# EAGLE design TesterMotorFaulhaber (EAGLE 9.6.2)
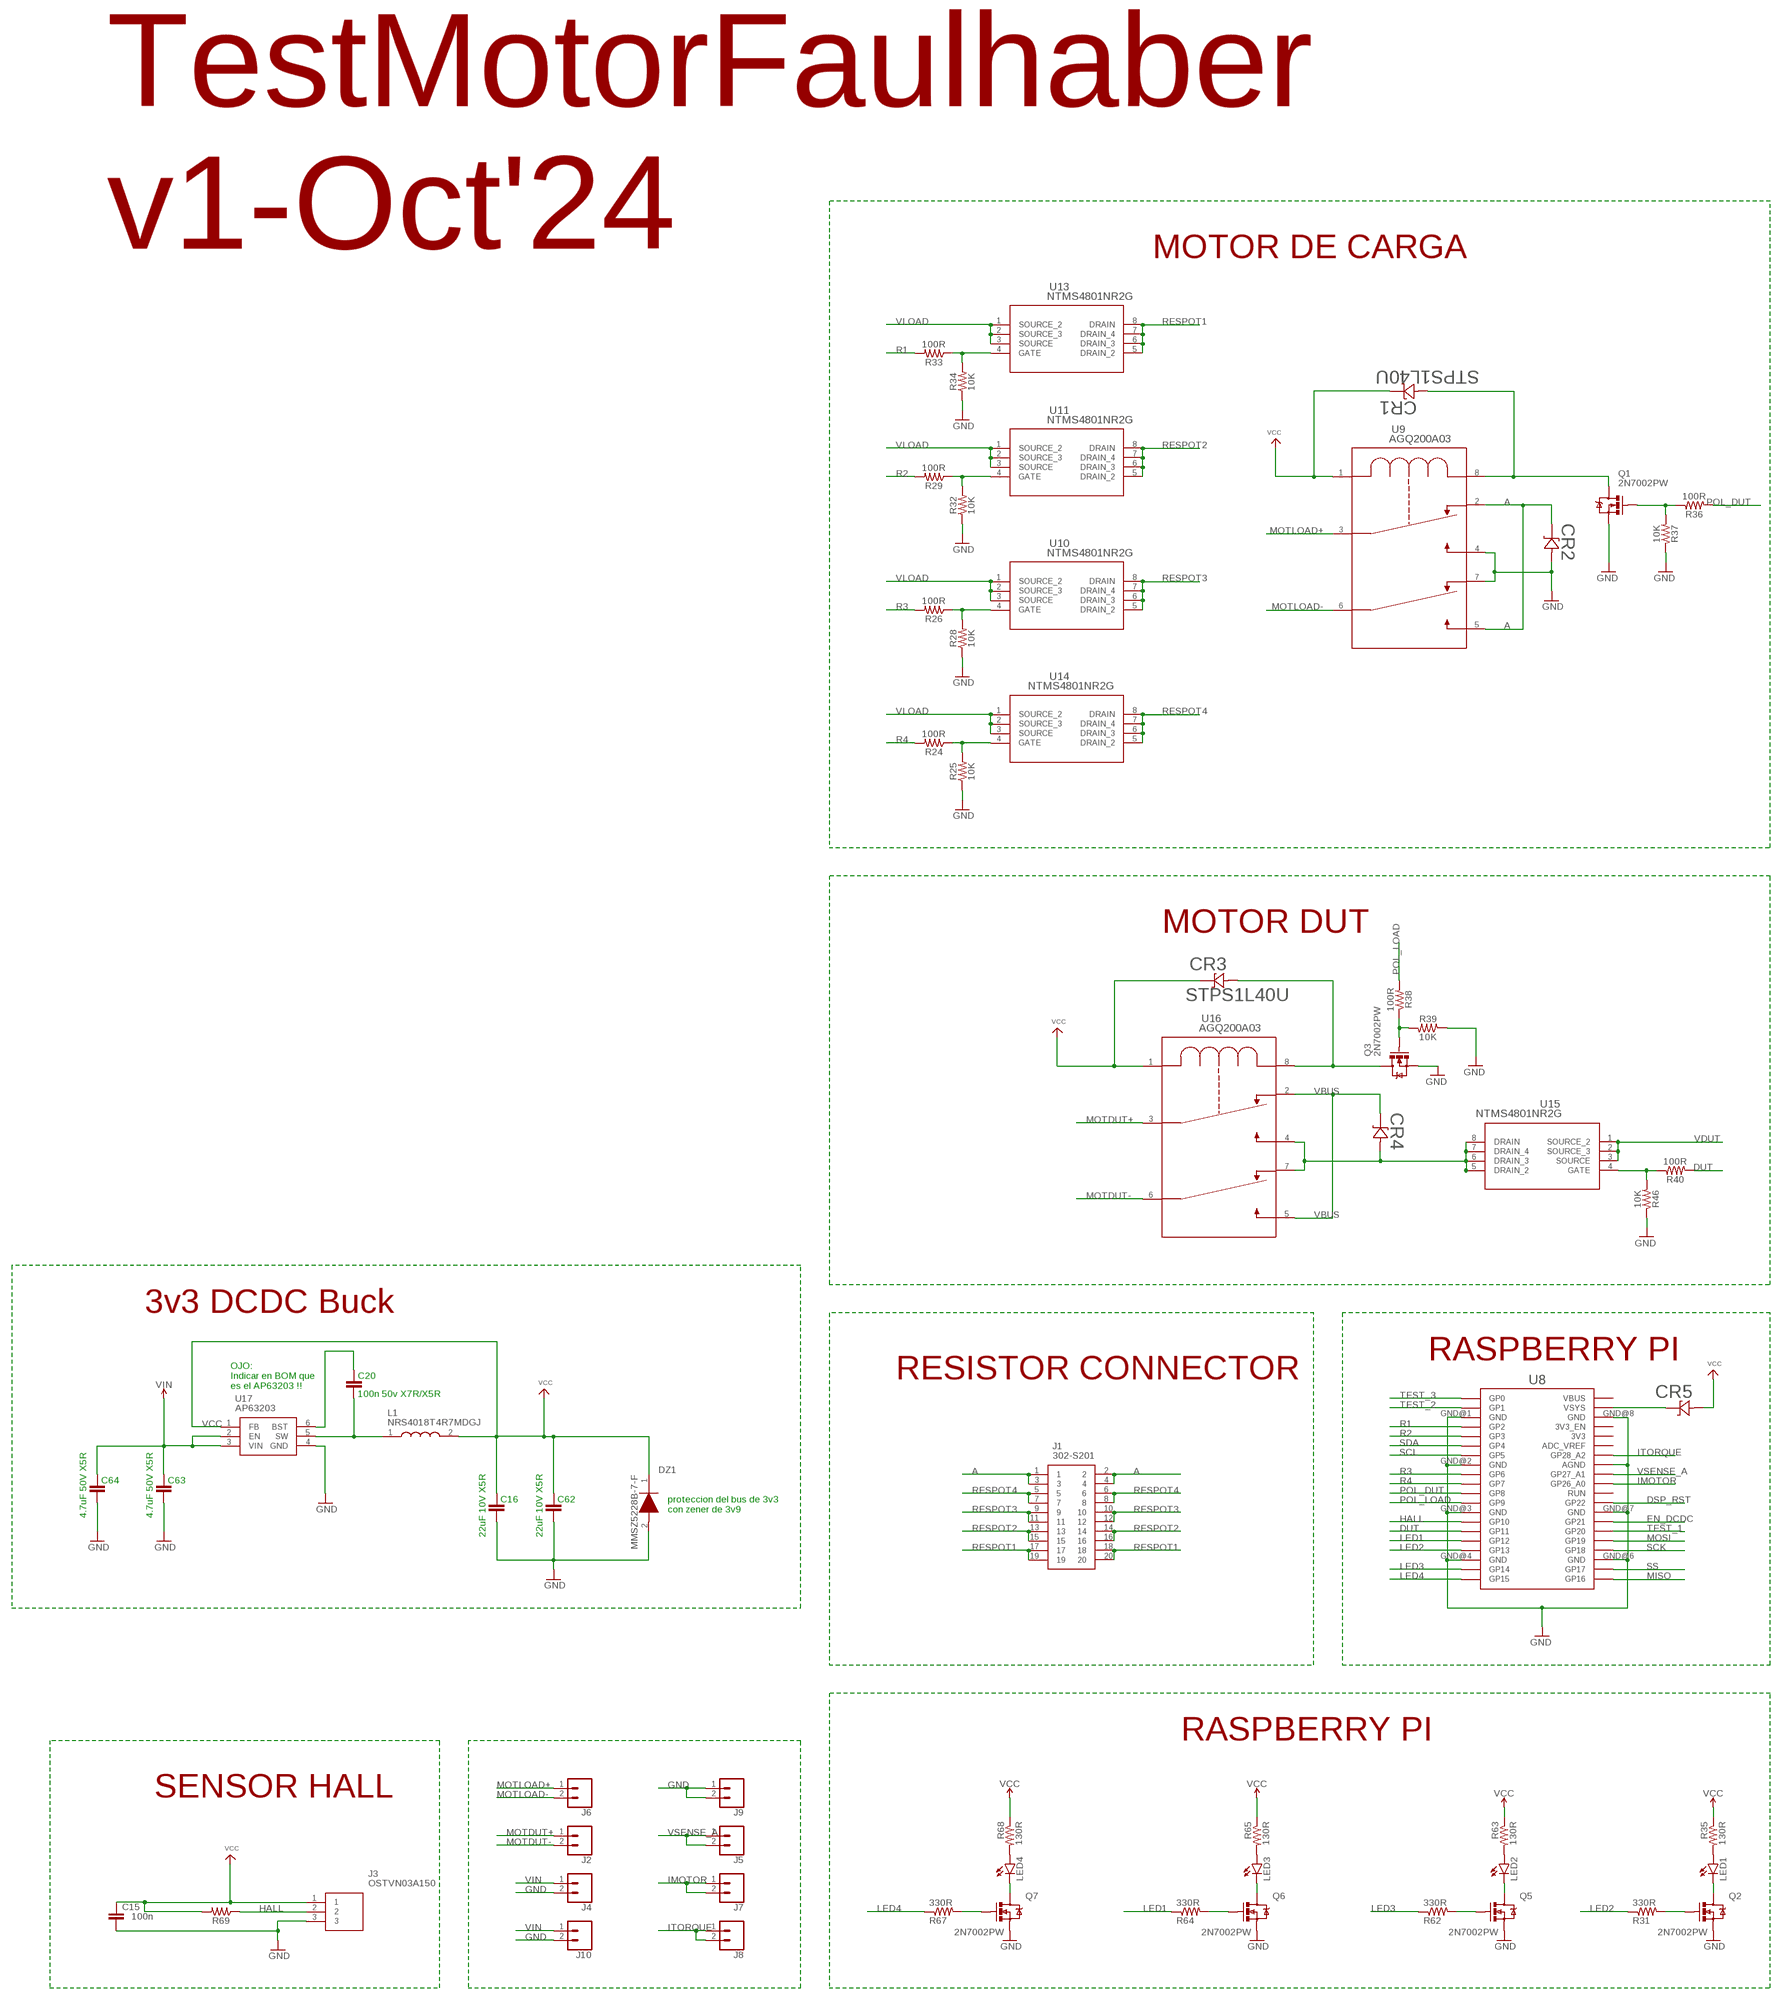
[diagram p0: schematic, sheet 1, part 1 of 2]
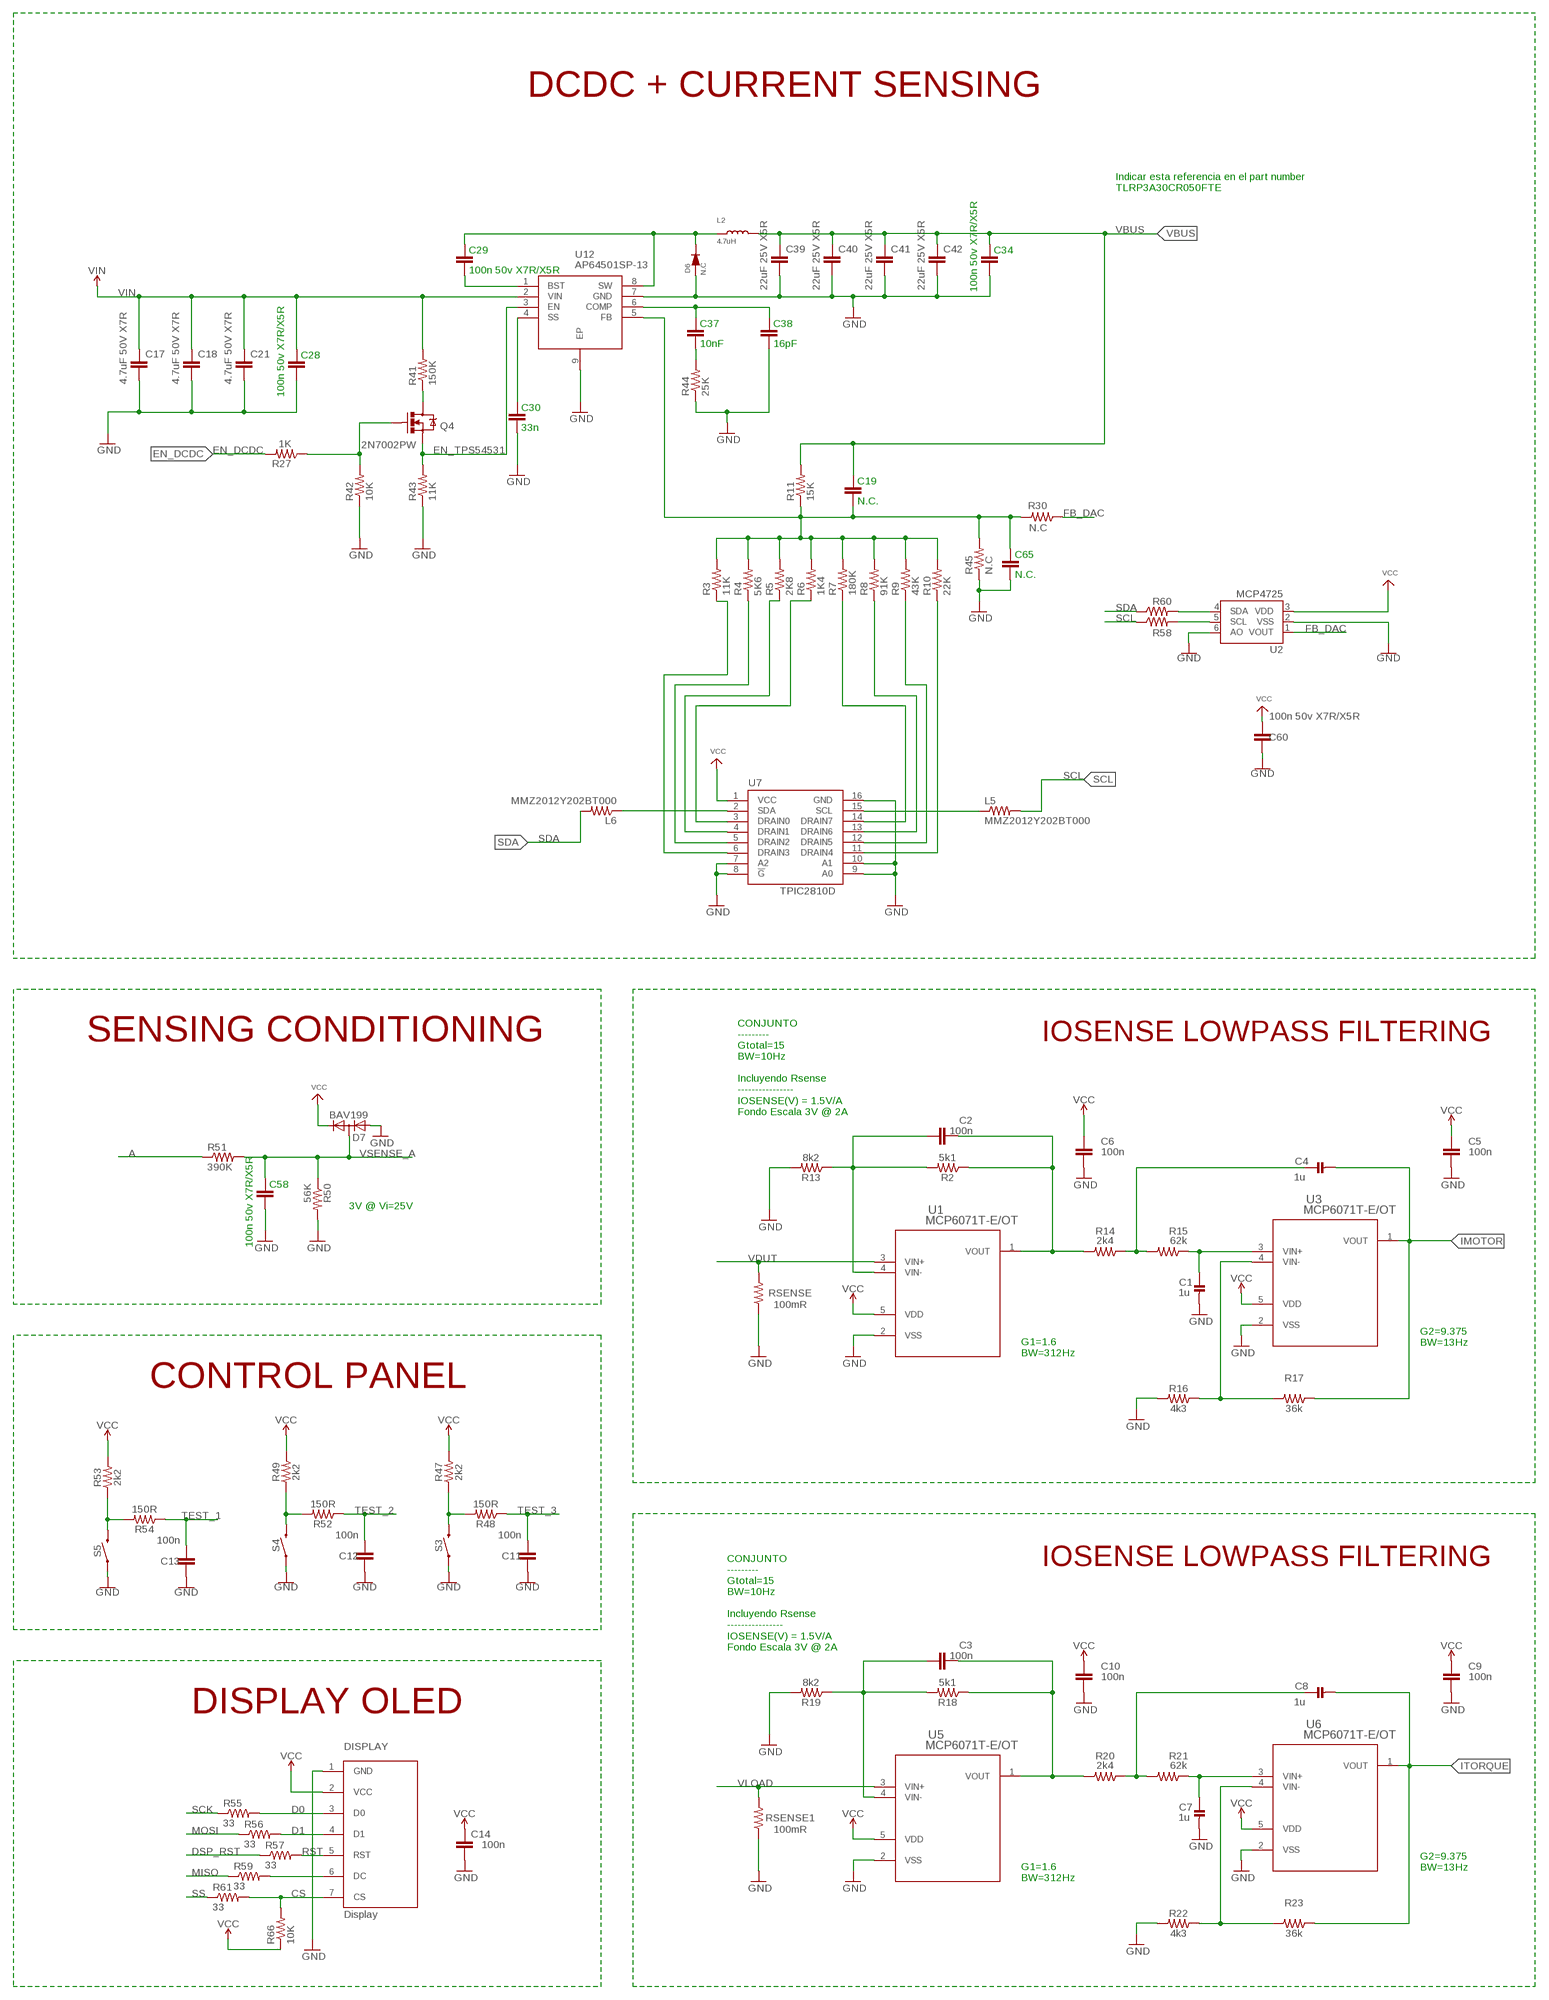
[diagram p1: schematic, sheet 1, part 2 of 2]

## Parts
C1  1u  CAP_CERAMIC0603_NO  [0603-NO]
C2  100n  0.1UF-0603-25V-(+80/-20%)  [0603]
C3  100n  0.1UF-0603-25V-(+80/-20%)  [0603]
C4  1u  CAP_CERAMIC0603_NO  [0603-NO]
C5  100n  0.1UF-0603-25V-(+80/-20%)  [0603]
C6  100n  0.1UF-0603-25V-(+80/-20%)  [0603]
C7  1u  CAP_CERAMIC0603_NO  [0603-NO]
C8  1u  CAP_CERAMIC0603_NO  [0603-NO]
C9  100n  0.1UF-0603-25V-(+80/-20%)  [0603]
C10  100n  0.1UF-0603-25V-(+80/-20%)  [0603]
C11  100n  1.0UF-0805-25V-(+80/-20%)  [0805]
C12  100n  1.0UF-0805-25V-(+80/-20%)  [0805]
C13  100n  1.0UF-0805-25V-(+80/-20%)  [0805]
C14  100n  1.0UF-0805-25V-(+80/-20%)  [0805]
C15  100n  1.0UF-0805-25V-(+80/-20%)  [0805]
C16  22uF 10V X5R  CAP0805  [0805]
C17  4.7uF 50V X7R  CAP1210  [1210]
C18  4.7uF 50V X7R  CAP1210  [1210]
C19  N.C.  CAP0805  [0805]
C20  100n 50v X7R/X5R  CAP0805  [0805]
C21  4.7uF 50V X7R  CAP1210  [1210]
C28  100n 50v X7R/X5R  CAP0805  [0805]
C29  100n 50v X7R/X5R  CAP0805  [0805]
C30  33n  CAP0805  [0805]
C34  100n 50v X7R/X5R  CAP0805  [0805]
C37  10nF  CAP0805  [0805]
C38  16pF  CAP0805  [0805]
C39  22uF 25V X5R  CAP1210  [1210]
C40  22uF 25V X5R  CAP1210  [1210]
C41  22uF 25V X5R  CAP1210  [1210]
C42  22uF 25V X5R  CAP1210  [1210]
C58  100n 50v X7R/X5R  CAP0805  [0805]
C60  100n 50v X7R/X5R  CAP0805  [0805]
C62  22uF 10V X5R  CAP0805  [0805]
C63  4.7uF 50V X5R  CAP0805  [0805]
C64  4.7uF 50V X5R  CAP0805  [0805]
C65  N.C.  CAP0805  [0805]
CR1  STPS1L40U  [SMB_STM]
CR2  STPS1L40U  [SMB_STM]
CR3  STPS1L40U  [SMB_STM]
CR4  STPS1L40U  [SMB_STM]
CR5  STPS1L40U  [SMB_STM]
D6  N.C  DSMC  [DO-214AB]
D7  BAV199  [SOT23]
DISPLAY  Display  OLED_LCD  [OLED_LCD]
DZ1  MMSZ5228B-7-F  [SODFL3518X115N]
J1  302-S201  [SHDR20W66P254_2X10_3300X905X90]
J2  CONN_02  [1X02]
J3  OSTVN03A150  [OSTVN03A150]
J4  CONN_02  [1X02]
J5  CONN_02  [1X02]
J6  CONN_02  [1X02]
J7  CONN_02  [1X02]
J8  CONN_02  [1X02]
J9  CONN_02  [1X02]
J10  CONN_02  [1X02]
L1  NRS4018T4R7MDGJ  [NRS4018T100MDGJ]
L2  4.7uH  L74437368047  [WE-LHMI]
L5  MMZ2012Y202BT000  RESISTOR0805-RES  [0805]
L6  MMZ2012Y202BT000  RESISTOR0805-RES  [0805]
LED1  LED3MM  [LED3MM]
LED2  LED3MM  [LED3MM]
LED3  LED3MM  [LED3MM]
LED4  LED3MM  [LED3MM]
Q1  2N7002PW  MOSFET-NCHANNEL2N7002PW  [SOT323]
Q2  2N7002PW  MOSFET-NCHANNEL2N7002PW  [SOT323]
Q3  2N7002PW  MOSFET-NCHANNEL2N7002PW  [SOT323]
Q4  2N7002PW  MOSFET-NCHANNEL2N7002PW  [SOT323]
Q5  2N7002PW  MOSFET-NCHANNEL2N7002PW  [SOT323]
Q6  2N7002PW  MOSFET-NCHANNEL2N7002PW  [SOT323]
Q7  2N7002PW  MOSFET-NCHANNEL2N7002PW  [SOT323]
R2  5k1  RESISTOR0805  [0805]
R3  11K  RESISTOR0805  [0805]
R4  5K6  RESISTOR0805  [0805]
R5  2K8  RESISTOR0805  [0805]
R6  1K4  RESISTOR0805  [0805]
R7  180K  RESISTOR0805  [0805]
R8  91K  RESISTOR0805  [0805]
R9  43K  RESISTOR0805  [0805]
R10  22K  RESISTOR0805  [0805]
R11  15K  RESISTOR0805  [0805]
R13  8k2  RESISTOR0805  [0805]
R14  2k4  RESISTOR0805  [0805]
R15  62k  RESISTOR0805  [0805]
R16  4k3  RESISTOR0805  [0805]
R17  36k  RESISTOR0805  [0805]
R18  5k1  RESISTOR0805  [0805]
R19  8k2  RESISTOR0805  [0805]
R20  2k4  RESISTOR0805  [0805]
R21  62k  RESISTOR0805  [0805]
R22  4k3  RESISTOR0805  [0805]
R23  36k  RESISTOR0805  [0805]
R24  100R  RESISTOR0805  [0805]
R25  10K  RESISTOR0805  [0805]
R26  100R  RESISTOR0805  [0805]
R27  1K  RESISTOR0805  [0805]
R28  10K  RESISTOR0805  [0805]
R29  100R  RESISTOR0805  [0805]
R30  N.C  RESISTOR0805  [0805]
R31  330R  RESISTOR0805  [0805]
R32  10K  RESISTOR0805  [0805]
R33  100R  RESISTOR0805  [0805]
R34  10K  RESISTOR0805  [0805]
R35  130R  RESISTOR0805  [0805]
R36  100R  RESISTOR0805  [0805]
R37  10K  RESISTOR0805  [0805]
R38  100R  RESISTOR0805  [0805]
R39  10K  RESISTOR0805  [0805]
R40  100R  RESISTOR0805  [0805]
R41  150K  RESISTOR0805  [0805]
R42  10K  RESISTOR0805  [0805]
R43  11K  RESISTOR0805  [0805]
R44  25K  RESISTOR0805  [0805]
R45  N.C  RESISTOR0805  [0805]
R46  10K  RESISTOR0805  [0805]
R47  2k2  RESISTOR0805  [0805]
R48  150R  RESISTOR0805  [0805]
R49  2k2  RESISTOR0805  [0805]
R50  56K  RESISTOR0805  [0805]
R51  390K  RESISTOR0805  [0805]
R52  150R  RESISTOR0805  [0805]
R53  2k2  RESISTOR0805  [0805]
R54  150R  RESISTOR0805  [0805]
R55  33  RESISTOR0805  [0805]
R56  33  RESISTOR0805  [0805]
R57  33  RESISTOR0805  [0805]
R58  N.C  RESISTOR0805  [0805]
R59  33  RESISTOR0805  [0805]
R60  N.C  RESISTOR0805  [0805]
R61  33  RESISTOR0805  [0805]
R62  330R  RESISTOR0805  [0805]
R63  130R  RESISTOR0805  [0805]
R64  330R  RESISTOR0805  [0805]
R65  130R  RESISTOR0805  [0805]
R66  10K  RESISTOR0805  [0805]
R67  330R  RESISTOR0805  [0805]
R68  130R  RESISTOR0805  [0805]
R69  RESISTOR0805  [0805]
RSENSE  100mR  RESISTOR1206  [1206]
RSENSE1  100mR  RESISTOR1206  [1206]
S3  MOMENTARY-SWITCH-SPST-SMD-5.2MM  [TACTILE_SWITCH_SMD_5.2MM]
S4  MOMENTARY-SWITCH-SPST-SMD-5.2MM  [TACTILE_SWITCH_SMD_5.2MM]
S5  MOMENTARY-SWITCH-SPST-SMD-5.2MM  [TACTILE_SWITCH_SMD_5.2MM]
U1  MCP6071T-E/OT  [SOT-23-5_MC_MCH]
U2  MCP4725  MCP4725SOT-23  [SOT23-6]
U3  MCP6071T-E/OT  [SOT-23-5_MC_MCH]
U5  MCP6071T-E/OT  [SOT-23-5_MC_MCH]
U6  MCP6071T-E/OT  [SOT-23-5_MC_MCH]
U7  TPIC2810D  [SO16]
U8  RPI_PICO_IG-TH  [RPI_PICO_TH]
U9  AGQ200A03  [RELAY_AGQ_A_PAN]
U10  NTMS4801NR2G  [SOIC8_4X5_ONS]
U11  NTMS4801NR2G  [SOIC8_4X5_ONS]
U12  AP64501SP-13  [SOIC127P600X163-9N]
U13  NTMS4801NR2G  [SOIC8_4X5_ONS]
U14  NTMS4801NR2G  [SOIC8_4X5_ONS]
U15  NTMS4801NR2G  [SOIC8_4X5_ONS]
U16  AGQ200A03  [RELAY_AGQ_A_PAN]
U17  AP63203  AP63201WU-7  [SOT95P280X100-6N]

## Nets
A: CR2.2 J1.1 J1.2 J1.3 J1.4 R51.1 U9.2 U9.5
CS: DISPLAY.7(CS) R61.2 R66.2
D0: DISPLAY.3(D0) R55.2
D1: DISPLAY.4(D1) R56.2
DSP_RST: R57.1 U8.GP22
DUT: R40.2 U8.GP11
EN_DCDC: R27.2 U8.GP21
EN_TPS54531: Q4.2(S) R43.2 U12.3(EN)
FB_DAC: R30.1 U2.1(VOUT)
GND: C1.2 C5.2 C6.2 C7.2 C9.2 C10.2 C11.1 C12.1 C13.1 C14.2 C15.2 C16.1 C17.2 C18.2 C21.2 C28.1 C30.1 C34.1 C38.1 C39.2 C40.2 C41.2 C42.2 C58.1 C60.1 C62.1 C63.1 C64.1 C65.1 CR2.1 D6.1(A) D7.1(A) DISPLAY.1(GND) DZ1.2(A) J3.3 J4.2 J9.1 J9.2 J10.2 Q1.2(S) Q2.2(S) Q3.2(S) Q5.2(S) Q6.2(S) Q7.2(S) R13.2 R16.2 R19.2 R22.2 R25.1 R28.1 R32.1 R34.1 R37.1 R39.1 R42.1 R43.1 R44.1 R45.1 R46.1 R50.2 RSENSE1.1 RSENSE.1 S3.1 S4.1 S5.1 U1.2(VSS) U2.2(VSS) U2.6(AO) U3.2(VSS) U5.2(VSS) U6.2(VSS) U7.7(A2) U7.8(!G) U7.9(A0) U7.10(A1) U7.16(GND) U8.AGND U8.GND@1(GND) U8.GND@2(GND) U8.GND@3(GND) U8.GND@4(GND) U8.GND@6(GND) U8.GND@7(GND) U8.GND@8(GND) U9.4 U9.7 U12.7(GND) U12.9(EP) U17.4(GND)
HALL: J3.2 R69.1 U8.GP10
IMOTOR: C4.2 J7.1 J7.2 R17.1 U3.1(VOUT) U8.GP26_A0
ISENSE_RAW: C2.1 R2.1 R14.2 U1.1(VOUT)
ISENSE_RAW1: C3.1 R18.1 R20.2 U5.1(VOUT)
ITORQUE: C8.2 J8.1 J8.2 R23.1 U6.1(VOUT) U8.GP28_A2
LED1: R64.1 U8.GP12
LED2: R31.1 U8.GP13
LED3: R62.1 U8.GP14
LED4: R67.1 U8.GP15
MISO: R59.1 U8.GP16
MOSI: R56.1 U8.GP19
MOTDUT+: J2.1 U16.3(3_2)
MOTDUT-: J2.2 U16.6
MOTLOAD+: J6.1 U9.3(3_2)
MOTLOAD-: J6.2 U9.6
N$1: R3.1 U7.6(DRAIN3)
N$2: R4.1 U7.5(DRAIN2)
N$3: R5.1 U7.4(DRAIN1)
N$4: R6.1 U7.3(DRAIN0)
N$5: R7.1 U7.14(DRAIN7)
N$6: C2.2 R2.2 R13.1 U1.4(VIN-)
N$7: R8.1 U7.13(DRAIN6)
N$8: R9.1 U7.12(DRAIN5)
N$9: R10.1 U7.11(DRAIN4)
N$11: LED1.A R35.2
N$12: LED1.K(C) Q2.3(D)
N$13: R16.1 R17.2 U3.4(VIN-)
N$14: C4.1 R14.1 R15.2
N$15: C1.1 R15.1 U3.3(VIN+)
N$17: C3.2 R18.2 R19.1 U5.4(VIN-)
N$18: R22.1 R23.2 U6.4(VIN-)
N$19: C19.1 C65.2 R3.2 R4.2 R5.2 R6.2 R7.2 R8.2 R9.2 R10.2 R11.1 R30.2 R45.2 U12.5(FB)
N$20: C8.1 R20.1 R21.2
N$21: Q2.1(G) R31.2
N$22: C7.1 R21.1 U6.3(VIN+)
N$24: R24.1 R25.2 U14.4(GATE)
N$25: R26.1 R28.2 U10.4(GATE)
N$26: R29.1 R32.2 U11.4(GATE)
N$27: R33.1 R34.2 U13.4(GATE)
N$28: Q1.1(G) R36.1 R37.2
N$29: CR1.1 Q1.3(D) U9.8
N$31: Q3.1(G) R38.1 R39.2
N$33: CR4.1 U15.5(DRAIN_2) U15.6(DRAIN_3) U15.7(DRAIN_4) U15.8(DRAIN) U16.4 U16.7
N$34: R40.1 R46.2 U15.4(GATE)
N$35: Q4.3(D) R41.1
N$38: R47.1 R48.2 S3.3
N$39: R49.1 R52.2 S4.3
N$40: L6.1 U7.2(SDA)
N$41: R53.1 R54.2 S5.3
N$43: DISPLAY.6(DC) R59.2
N$44: C30.2 U12.4(SS)
N$45: R58.2 U2.5(SCL)
N$47: C29.1 U12.1(BST)
N$48: R60.2 U2.4(SDA)
N$49: Q5.1(G) R62.2
N$50: LED2.A R63.2
N$51: C29.2 D6.2(K) L2.1 U12.8(SW)
N$52: C37.2 C38.2 U12.6(COMP)
N$53: C37.1 R44.2
N$54: L5.1 U7.15(SCL)
N$55: LED2.K(C) Q5.3(D)
N$56: Q6.1(G) R64.2
N$58: LED3.A R65.2
N$59: LED3.K(C) Q6.3(D)
N$62: Q7.1(G) R67.2
N$63: LED4.A R68.2
N$64: LED4.K(C) Q7.3(D)
N$69: C20.2 U17.6(BST)
N$70: C20.1 L1.1 U17.5(SW)
N$75: CR5.2 U8.VSYS
N$78: CR3.1 Q3.3(D) U16.8
POL_DUT: R36.2 U8.GP8
POL_LOAD: R38.2 U8.GP9
R1: R33.2 U8.GP2
R2: R29.2 U8.GP3
R3: R26.2 U8.GP6
R4: R24.2 U8.GP7
RESPOT1: J1.17 J1.18 J1.19 J1.20 U13.5(DRAIN_2) U13.6(DRAIN_3) U13.7(DRAIN_4) U13.8(DRAIN)
RESPOT2: J1.13 J1.14 J1.15 J1.16 U11.5(DRAIN_2) U11.6(DRAIN_3) U11.7(DRAIN_4) U11.8(DRAIN)
RESPOT3: J1.9 J1.10 J1.11 J1.12 U10.5(DRAIN_2) U10.6(DRAIN_3) U10.7(DRAIN_4) U10.8(DRAIN)
RESPOT4: J1.5 J1.6 J1.7 J1.8 U14.5(DRAIN_2) U14.6(DRAIN_3) U14.7(DRAIN_4) U14.8(DRAIN)
RST: DISPLAY.5(RST) R57.2
SAFETY_EN_DCDC: Q4.1(G) R27.1 R42.2
SCK: R55.1 U8.GP18
SCL: L5.2 R58.1 U8.GP5
SDA: L6.2 R60.1 U8.GP4
SS: R61.1 U8.GP17
TEST_1: C13.2 R54.1 U8.GP20
TEST_2: C12.2 R52.1 U8.GP1
TEST_3: C11.2 R48.1 U8.GP0
VBUS: C19.2 C34.2 C39.1 C40.1 C41.1 C42.1 CR4.2 L2.2 R11.2 U16.2 U16.5
VCC: C5.1 C6.1 C9.1 C10.1 C14.1 C15.1 C16.2 C60.2 C62.2 CR1.2 CR3.2 CR5.1 D7.2(C) DISPLAY.2(VCC) DZ1.1(K) J3.1 L1.2 R35.1 R47.2 R49.2 R53.2 R63.1 R65.1 R66.1 R68.1 R69.2 U1.5(VDD) U2.3(VDD) U3.5(VDD) U5.5(VDD) U6.5(VDD) U7.1(VCC) U9.1 U16.1 U17.1(FB)
VDUT: RSENSE.2 U1.3(VIN+) U15.1(SOURCE_2) U15.2(SOURCE_3) U15.3(SOURCE)
VIN: C17.1 C18.1 C21.1 C28.2 C63.2 C64.2 J4.1 J10.1 R41.2 U12.2(VIN) U17.2(EN) U17.3(VIN)
VLOAD: RSENSE1.2 U5.3(VIN+) U10.1(SOURCE_2) U10.2(SOURCE_3) U10.3(SOURCE) U11.1(SOURCE_2) U11.2(SOURCE_3) U11.3(SOURCE) U13.1(SOURCE_2) U13.2(SOURCE_3) U13.3(SOURCE) U14.1(SOURCE_2) U14.2(SOURCE_3) U14.3(SOURCE)
VSENSE_A: C58.2 D7.3(AC) J5.1 J5.2 R50.1 R51.2 U8.GP27_A1
Unconnected: U8.3V3 U8.3V3_EN U8.ADC_VREF U8.RUN U8.VBUS

## Notes on the sheet
- TestMotorFaulhaber
  v1-Oct'24
- MOTOR DE CARGA
- DCDC + CURRENT SENSING
- Indicar esta referencia en el part number
  TLRP3A30CR050FTE
- MOTOR DUT
- SENSING CONDITIONING | IOSENSE LOWPASS FILTERING
- CONJUNTO
  ---------
  Gtotal=15
  BW=10Hz
  
  Incluyendo Rsense
  ----------------
  IOSENSE(V) = 1.5V/A
  Fondo Escala 3V @ 2A
- 3V @ Vi=25V
- 3v3 DCDC Buck
- RASPBERRY PI
- RESISTOR CONNECTOR
- OJO:
  Indicar en BOM que 
  es el AP63203 !!
- G2=9.375
  BW=13Hz
- G1=1.6
  BW=312Hz
- CONTROL PANEL
- proteccion del bus de 3v3
  con zener de 3v9
- IOSENSE LOWPASS FILTERING
- CONJUNTO
  ---------
  Gtotal=15
  BW=10Hz
  
  Incluyendo Rsense
  ----------------
  IOSENSE(V) = 1.5V/A
  Fondo Escala 3V @ 2A
- RASPBERRY PI | DISPLAY OLED
- SENSOR HALL
- G2=9.375
  BW=13Hz
- G1=1.6
  BW=312Hz

## Library data of the parts
C1 C4 C7 C8 = microbuilder:CAP_CERAMIC: Ceramic Capacitors For new designs, use the packages preceded by an '_' character since they are more reliable: The following footprints should be used on most boards: _0402 - Standard footprint for regular board layouts _0603 - Standard footprint for regular board layouts _0805 - Standard footprint for regular board layouts _1206 - Standard footprint for regular board layouts For extremely tight-pitch boards where space is at a premium, the following 'micro-pitch' footprints can be used (smaller pads, no silkscreen outline, etc.): _0402MP - Micro-pitch footprint for very dense/compact boards _0603MP - Micro-pitch footprint for very dense/compact boards _0805MP - Micro-pitch footprint for very dense/compact boards _1206MP - Micro-pitch footprint for very dense/compact boards
C2 C3 C5 C6 C9 C10 = SparkFun-Capacitors:0.1UF: 0.1µF ceramic capacitors A capacitor is a passive two-terminal electrical component used to store electrical energy temporarily in an electric field.; PROD_ID: CAP-00810; VALUE: 0.1uF
C11-C15 = SparkFun-Capacitors:1.0UF: 1µF ceramic capacitors A capacitor is a passive two-terminal electrical component used to store electrical energy temporarily in an electric field.; PROD_ID: CAP-11625; VALUE: 1.0uF
C16-C21 C28-C30 C34 C37-C42 C58 C60 C62-C65 = SparkFun-Passives:CAP: Capacitor Standard 0603 ceramic capacitor, and 0.1" leaded capacitor.
CR1-CR5 = STPS1L40U:STPS1L40U; COPYRIGHT: Copyright (C) 2024 Ultra Librarian. All rights reserved.; MANUFACTURER_PART_NUMBER: STPS1L40U; MFR_NAME: STMicroelectronics
D6 = EDCPSU - Rev3:D*
D7 = diode:BAV199: DIODE low-leakage double diode
DISPLAY = EDCPSU:OLED_LCD
DZ1 = MMSZ5228B-7-F:MMSZ5228B-7-F: Diodes Inc MMSZ5228B-7-F Zener Diode, 3.9V 5% 500 mW SMT 2-Pin SOD-123 Source: Datasheet <http://au.rs-online.com/web/p/products/8231502P>; DESCRIPTION: Diodes Inc MMSZ5228B-7-F Zener Diode, 3.9V 5% 500 mW SMT 2-Pin SOD-123; HEIGHT: 1.15mm; MANUFACTURER_NAME: Diodes Inc.; MANUFACTURER_PART_NUMBER: MMSZ5228B-7-F
J1 = 302-S201:302-S201: CONN HEADER VERT 20POS GOLD Source: Datasheet <http://www.on-shore.com/wp-content/uploads/2018/04/302-SXX1.pdf>; DESCRIPTION: CONN HEADER VERT 20POS GOLD; HEIGHT: 9.05mm; MANUFACTURER_NAME: On Shore Technology Inc.; MANUFACTURER_PART_NUMBER: 302-S201
J2 J4-J10 = SparkFun-Connectors:CONN_02: Multi connection point. Often used as Generic Header-pin footprint for 0.1 inch spaced/style header connections On any of the 0.1 inch spaced packages, you can populate with these: Break Away Headers - Straight <https://www.sparkfun.com/products/116> (PRT-00116) Break Away Male Headers - Right Angle <https://www.sparkfun.com/products/553> (PRT-00553) Female Headers <https://www.sparkfun.com/products/115> (PRT-00115) Break Away Headers - Machine Pin <https://www.sparkfun.com/products/117> (PRT-00117) Break Away Female Headers - Swiss Machine Pin <https://www.sparkfun.com/products/743> (PRT-00743) For SCREWTERMINALS and SPRING TERMINALS visit here: Screw Terimnals on SparkFun.com <https://www.sparkfun.com/search/results?term=Screw+Terminals> (5mm/3.5mm/2.54mm spacing) This device is also useful as a general connection point to wire up your design to another part of your project. Our various solder wires solder well into these plated through hole pads. Hook-Up Wire - Assortment (Stranded, 22 AWG) <https://www.sparkfun.com/products/11375> (PRT-11375) Hook-Up Wire - Assortment (Solid Core, 22 AWG) <https://www.sparkfun.com/products/11367> (PRT-11367) View the entire wire category on our website here <https://www.sparkfun.com/categories/141> Special notes: Molex polarized connector foot print use with: PRT-08233 with associated crimp pins and housings. 2.54_SCREWTERM for use with PRT-10571. 3.5mm Screw Terminal footprints for PRT-08084 5mm Screw Terminal footprints for use with PRT-08432
J3 = OSTVN03A150:OSTVN03A150: OSTVN03A150 Source: Datasheet <https://www.on-shore.com/wp-content/uploads/OSTVNXXA150.pdf>; ARROW_PART_NUMBER: OSTVN03A150; ARROW_PRICE-STOCK: https://www.arrow.com/en/products/ostvn03a150/on-shore-technology; DESCRIPTION: OSTVN03A150; HEIGHT: 8.8mm; MANUFACTURER_NAME: On-Shore Technology, Inc; MANUFACTURER_PART_NUMBER: OSTVN03A150
L1 = NRS4018T4R7MDGJ:NRS4018T4R7MDGJ: Inductor SMD wirewound 4.7uH Source: Datasheet <https://datasheet.datasheetarchive.com/originals/distributors/Datasheets-DGA11/2190982.pdf>; ARROW_PART_NUMBER: NRS4018T4R7MDGJ; ARROW_PRICE-STOCK: https://www.arrow.com/en/products/nrs4018t4r7mdgj/taiyo-yuden; DESCRIPTION: Inductor SMD wirewound 4.7uH; HEIGHT: 1mm; MANUFACTURER_NAME: TAIYO YUDEN; MANUFACTURER_PART_NUMBER: NRS4018T4R7MDGJ; MOUSER_PART_NUMBER: 963-NRS4018T4R7MDGJ; MOUSER_PRICE-STOCK: https://www.mouser.co.uk/ProductDetail/Taiyo-Yuden/NRS4018T4R7MDGJ?qs=PzICbMaShUfBUWy4ytltsA%3D%3D
L2 = EDCPSU - Rev3:L*
L5 L6 = SparkFun:RESISTOR: Resistor Basic schematic elements and footprints for 0603, 1206, and PTH resistors.
LED1-LED4 = SparkFun-LED:LED: LEDs Standard schematic elements and footprints for 5mm, 3mm, 1206, and 0603 sized LEDs. 5mm - Spark Fun Electronics SKU : COM-00529 (and others)
Q1-Q7 = SparkFun-DiscreteSemi:MOSFET-NCHANNEL: Common NMOSFET Parts MFG P/N Store ID Prod ID FDD8780 TRANS-09984 SI7820DN TRANS-11055 FDS6630A IC-08089 2N7002PW TRANS-11151 FQP30N06L COM-10213 TRANS-10060 BSS123LT1G TRANS-08345 BSS138 TRANS-00830 BS170 2N7000; PROD_ID: TRANS-11151
R2-R11 R13-R69 RSENSE RSENSE1 = SparkFun-Resistors:RESISTOR: Generic Resistor Package
S3-S5 = SparkFun-Switches:MOMENTARY-SWITCH-SPST: Momentary Switch (Pushbutton) - SPST Normally-open (NO) SPST momentary switches (buttons, pushbuttons). Variants PTH-12MM - 12mm square, through-hole Momentary Pushbutton Switch - 12mm Square <https://www.sparkfun.com/products/9190> (COM-09190) PTH-6.0MM, PTH-6.0MM-KIT - 6.0mm square, through-hole Mini Pushbutton Switch <https://www.sparkfun.com/products/97> (COM-00097) KIT package intended for soldering kit's - only one side of pads' copper is exposed. PTH-RIGHT-ANGLE-KIT - Right-angle, through-hole Right Angle Tactile Button <https://www.sparkfun.com/products/10791> - Used on SparkFun BigTime Watch Kit <https://www.sparkfun.com/products/11734> SMD-12MM - 12mm square, surface-mount Tactile Button - SMD (12mm) <https://www.sparkfun.com/products/12993> (COM-12993) Used on SparkFun PicoBoard <https://www.sparkfun.com/products/11888> SMD-4.5MM - 4.5mm Square Trackball Switch Used on SparkFun Blackberry Trackballer Breakout <https://www.sparkfun.com/products/13169> SMD-4.6MMX2.8MM - 4.60mm x 2.80mm, surface mount Used on SparkFun SAMD21 Mini Breakout <https://www.sparkfun.com/products/13664> SMD-5.2MM, SMD-5.2-REDUNDANT - 5.2mm square, surface-mount Mini Pushbutton Switch - SMD <https://www.sparkfun.com/products/8720> (COM-08720) Used on Arduino Pro Mini <https://www.sparkfun.com/products/11114> REDUNDANT package connects both switch circuits together SMD-6.0X3.5MM - 6.0 x 3.5mm, surface mount Momentary Reset Switch SMD <https://www.sparkfun.com/products/8229> (COM-08229) SMD-6.2MM-TALL - 6.2mm square, surface mount Tactile Button - SMD (6mm) <https://www.sparkfun.com/products/12992> Used on SparkFun Digital Sandbox <https://www.sparkfun.com/products/12651> SMD-RIGHT-ANGLE - Right-angle, surface mount Used on SparkFun Block for Intel® Edison - Arduino <https://www.sparkfun.com/products/13036>; PROD_ID: SWCH-08247; SF_SKU: COM-08720
U1 U3 U5 U6 = MCP6071:MCP6071T-E/OT; BUILT_BY: EMA_Jessica; COPYRIGHT: Copyright (C) 2018 Accelerated Designs. All rights reserved; MANUFACTURER_PART_NUMBER: MCP6071T-E/OT; SOURCELIBRARY: Microchip_2019-08-23_21; VENDOR: Microchip
U2 = SparkFun-IC-Conversion:MCP4725: MCP4725 DAC Microchip 12-bit I2C DAC, SOT23-6 Datasheet <https://cdn.sparkfun.com/datasheets/BreakoutBoards/MCP4725_2009.pdf> SparkFun Products SparkFun I2C DAC Breakout - MCP4725 <https://www.sparkfun.com/products/12918> (BOB-12918); PROD_ID: IC-08886
U7 = EDCPSU - Rev2:TPIC2810D
U8 = RaspberryPi_Pico:RPI_PICO_IG
U9 U16 = AGQ200A03:AGQ200A03; COPYRIGHT: Copyright (C) 2024 Ultra Librarian. All rights reserved.; MANUFACTURER_PART_NUMBER: AGQ200A03; MFR_NAME: Panasonic
U10 U11 U13-U15 = NTMS4801NR2G:NTMS4801NR2G; COPYRIGHT: Copyright (C) 2024 Ultra Librarian. All rights reserved.; MANUFACTURER_PART_NUMBER: NTMS4801NR2G; MFR_NAME: onsemi
U12 = AP64501SP-13:AP64501SP-13: Conv DC-DC 3.8V to 40V Synchronous Step Down Single-Out 0.8V to 39V 5A 8-Pin SO EP T/R Source: Datasheet <https://www.arrow.com/en/products/ap64501sp-13/diodes-incorporated>; ARROW_PART_NUMBER: AP64501SP-13; ARROW_PRICE-STOCK: https://www.arrow.com/en/products/ap64501sp-13/diodes-incorporated?region=nac; DESCRIPTION: Conv DC-DC 3.8V to 40V Synchronous Step Down Single-Out 0.8V to 39V 5A 8-Pin SO EP T/R; HEIGHT: 1.63mm; MANUFACTURER_NAME: Diodes Inc.; MANUFACTURER_PART_NUMBER: AP64501SP-13; MOUSER_PART_NUMBER: 621-AP64501SP-13; MOUSER_PRICE-STOCK: https://www.mouser.co.uk/ProductDetail/Diodes-Incorporated/AP64501SP-13?qs=P1JMDcb91o7FS0GU%252BW7TIQ%3D%3D
U17 = AP63201WU-7:AP63201WU-7: Switching Voltage Regulators DCDC Conv HV Buck TSOT26 T&R 3K Source: Datasheet <https://mouser.componentsearchengine.com/Datasheets/1/AP63201WU-7.pdf>; ARROW_PART_NUMBER: AP63201WU-7; ARROW_PRICE-STOCK: https://www.arrow.com/en/products/ap63201wu-7/diodes-incorporated?region=nac; DESCRIPTION: Switching Voltage Regulators DCDC Conv HV Buck TSOT26 T&R 3K; HEIGHT: 1mm; MANUFACTURER_NAME: Diodes Inc.; MANUFACTURER_PART_NUMBER: AP63201WU-7; MOUSER_PART_NUMBER: 621-AP63201WU-7; MOUSER_PRICE-STOCK: https://www.mouser.co.uk/ProductDetail/Diodes-Incorporated/AP63201WU-7?qs=u16ybLDytRaVD%252BU3eG30NA%3D%3D

## Board
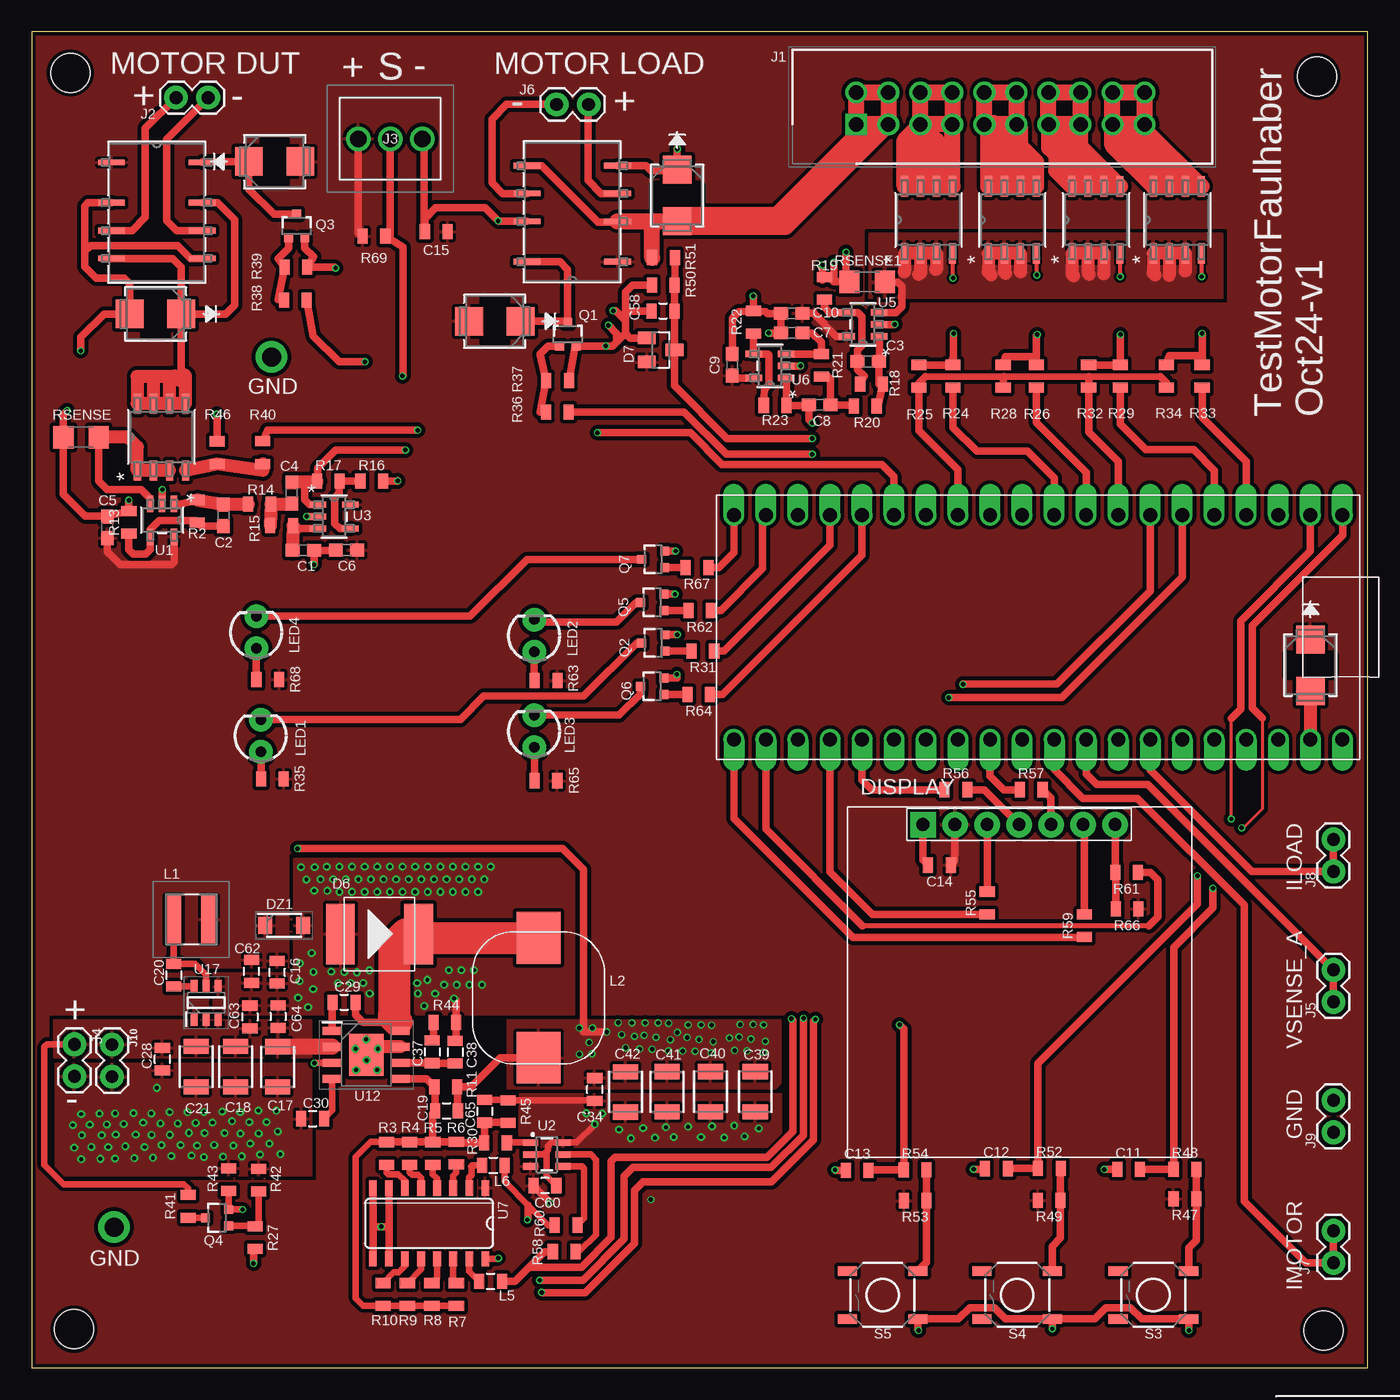
[diagram p2: board, top side]
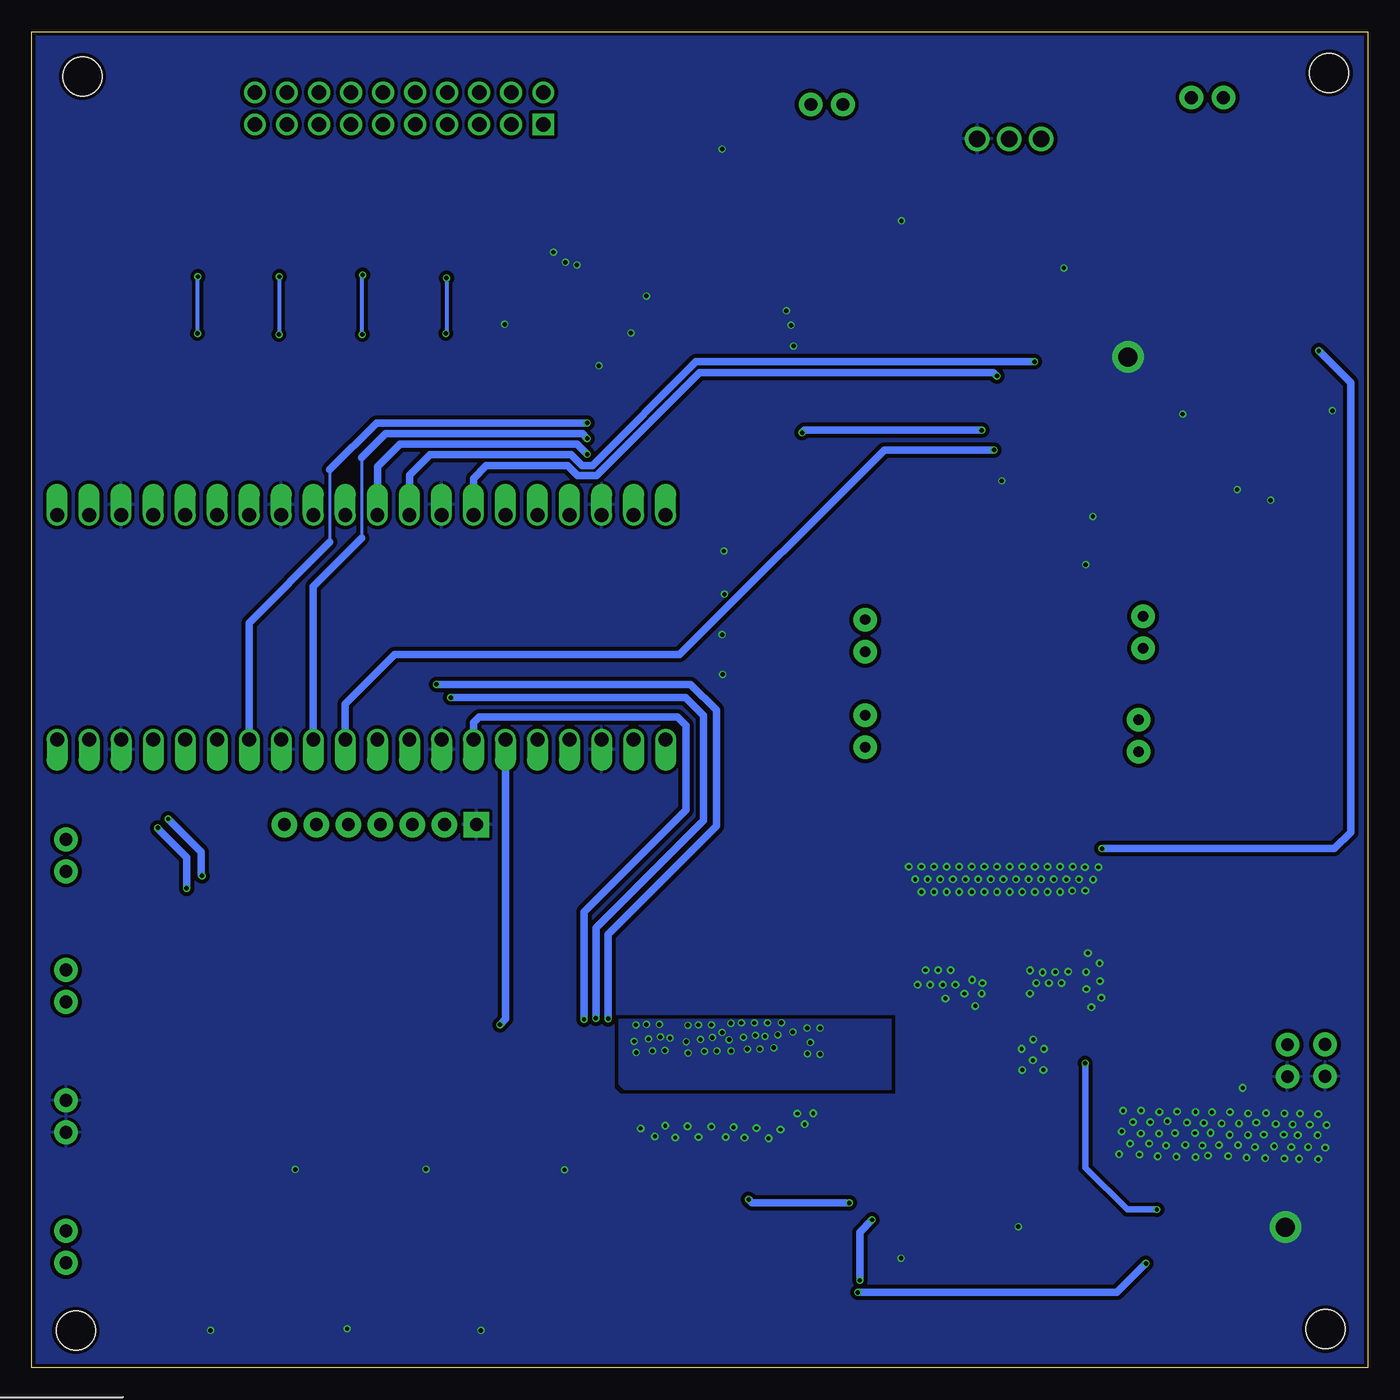
[diagram p3: board, bottom side, seen from below]

Size 106 x 106 mm. Coordinates in mm from the lower left corner, seen from the top.
Outline: 0,0 106,0 106,106 0,106 0,0
Copper layers (1*16): Top 0.035mm / dielectric 1.5mm / Bottom 0.035mm
Design rules "default *": minimum track width 8mil, minimum drill 12mil, track to track 8mil, track to pad 8mil, pad to pad 8mil, via to via 8mil, smd to smd 0mil, copper to edge 10mil, drill to drill 8mil, minimum pad ring 6mil, minimum via ring 4mil, stop-mask expansion 4mil, vias tented up to drill 25mil, thermal gap 10mil
Holes 3.1 mm at 102.48,2.97 3.36,3.08 3.08,102.71 101.96,102.43

### Footprints (pad centres in the part's own frame; a part is rotated, then mirrored left to right if it is on the bottom)
0603-NO = smd 1.1 x 1: 1 -0.85,0; 2 0.85,0
0603 = smd 1.1 x 1: 1 -0.85,0; 2 0.85,0
0805 = smd 0.8 x 1.2: 1 -0.9,0; 2 0.9,0
1210 = smd 1.2 x 2: 1 -1.6,0; 2 1.6,0
SMB_STM = smd 2.21 x 2.261: 1 -2.045,0; 2 2.045,0
DO-214AB = smd 2.286 x 4.8: 1 -3.1,0; 2 3.1,0
SOT23 = smd 1 x 1.4: 1 -0.95,-1.1; 2 0.95,-1.1; 3 0,1.1
OLED_LCD = drill 1.016 pad 2.032 square: 1 -7.42,13.7 | drill 1.016 pad 2.032: 2 -4.88,13.7; 3 -2.34,13.7; 4 0.2,13.7; 5 2.74,13.7; 6 5.28,13.7; 7 7.82,13.7
SODFL3518X115N = smd 1.12 x 1.37: 1 -1.5,0; 2 1.5,0
SHDR20W66P254_2X10_3300X905X90 = drill 1.15 pad 1.725 square: 1 0,0 | drill 1.15 pad 1.725: 2 0,2.54; 3 2.54,0; 4 2.54,2.54; 5 5.08,0; 6 5.08,2.54; 7 7.62,0; 8 7.62,2.54; 9 10.16,0; 10 10.16,2.54; 11 12.7,0; 12 12.7,2.54; 13 15.24,0; 14 15.24,2.54; 15 17.78,0; 16 17.78,2.54; 17 20.32,0; 18 20.32,2.54; 19 22.86,0; 20 22.86,2.54
1X02 = drill 1.016 pad 1.88: 1 0,0; 2 2.54,0
OSTVN03A150 = drill 1.3 pad 1.95: 1 0,0; 2 2.54,0; 3 5.08,0
NRS4018T100MDGJ = smd 1.2 x 3.7: 1 -1.4,0; 2 1.4,0
WE-LHMI = smd 4.1 x 3.5: 1 -4.75,0; 2 4.75,0
LED3MM = drill 0.813 pad 1.88: A -1.27,0; K 1.27,0
SOT323 = smd 0.7 x 0.7: 1 -0.65,-0.925; 2 0.65,-0.925; 3 0,0.925
1206 = smd 1.6 x 1.8: 1 -1.4,0; 2 1.4,0
TACTILE_SWITCH_SMD_5.2MM = smd 1.524 x 0.762: 1 -2.794,1.905; 2 2.794,1.905; 3 -2.794,-1.905; 4 2.794,-1.905
SOT-23-5_MC_MCH = smd 1.31 x 0.508: 1 -1.295,0.95; 2 -1.295,0; 3 -1.295,-0.95; 4 1.295,-0.95; 5 1.295,0.95
SOT23-6 = smd 0.55 x 1.2: 1 0.95,1.3; 2 0,1.3; 3 -0.95,1.3; 4 -0.95,-1.3; 5 0,-1.3; 6 0.95,-1.3
SO16 = smd 0.6 x 1.2: 1 -4.445,-2.8; 2 -3.175,-2.8; 3 -1.905,-2.8; 4 -0.635,-2.8; 5 0.635,-2.8; 6 1.905,-2.8; 7 3.175,-2.8; 8 4.445,-2.8; 9 4.445,2.8; 10 3.175,2.8; 11 1.905,2.8; 12 0.635,2.8; 13 -0.635,2.8; 14 -1.905,2.8; 15 -3.175,2.8; 16 -4.445,2.8
RPI_PICO_TH = drill 1.1 pad 1.6 offset: 3V3 8.89,13.97; 3V3_EN 8.89,16.51; ADC_VREF 8.89,11.43; AGND 8.89,6.35; GND@1 -8.89,19.05; GND@2 -8.89,6.35; GND@3 -8.89,-6.35; GND@4 -8.89,-19.05; GND@6 8.89,-19.05; GND@7 8.89,-6.35; GND@8 8.89,19.05; GP0 -8.89,24.13; GP1 -8.89,21.59; GP2 -8.89,16.51; GP3 -8.89,13.97; GP4 -8.89,11.43; GP5 -8.89,8.89; GP6 -8.89,3.81; GP7 -8.89,1.27; GP8 -8.89,-1.27; GP9 -8.89,-3.81; GP10 -8.89,-8.89; GP11 -8.89,-11.43; GP12 -8.89,-13.97; GP13 -8.89,-16.51; GP14 -8.89,-21.59; GP15 -8.89,-24.13; GP16 8.89,-24.13; GP17 8.89,-21.59; GP18 8.89,-16.51; GP19 8.89,-13.97; GP20 8.89,-11.43; GP21 8.89,-8.89; GP22 8.89,-3.81; GP26_A0 8.89,1.27; GP27_A1 8.89,3.81; GP28_A2 8.89,8.89; RUN 8.89,-1.27; VBUS 8.89,24.13; VSYS 8.89,21.59
RELAY_AGQ_A_PAN = smd 2.134 x 0.457: 1 -3.594,3.95; 2 -3.594,0.749; 3 -3.594,-1.46; 4 -3.594,-3.67; 5 3.594,-3.67; 6 3.594,-1.46; 7 3.594,0.749; 8 3.594,3.95
SOIC8_4X5_ONS = smd 1.6 x 0.559: 1 -2.654,1.905; 2 -2.654,0.635; 3 -2.654,-0.635; 4 -2.654,-1.905; 5 2.654,-1.905; 6 2.654,-0.635; 7 2.654,0.635; 8 2.654,1.905
SOIC127P600X163-9N = smd 1.5 x 0.65: 1 -2.7,1.905; 2 -2.7,0.635; 3 -2.7,-0.635; 4 -2.7,-1.905; 5 2.7,-1.905; 6 2.7,-0.635; 7 2.7,0.635; 8 2.7,1.905 | smd 2.71 x 3.35: 9 0,0
SOT95P280X100-6N = smd 1.05 x 0.55: 1 -1.3,0.95; 2 -1.3,0; 3 -1.3,-0.95; 4 1.3,-0.95; 5 1.3,0; 6 1.3,0.95

### Placement (x,y rotation side)
C1  21.55,64.85 0 top
C2  15.23,67.63 270 top
C3  66.35,79.83 180 top
C4  20.65,69.4 90 top
C5  6.02,66.68 90 top
C6  24.99,64.88 180 top
C7  60.3,82.09 180 top
C8  62.52,76.39 180 top
C9  55.58,79.55 90 top
C10  60.29,83.65 180 top
C11  87.02,15.75 0 top
C12  76.53,15.82 0 top
C13  65.49,15.69 0 top
C14  72.01,39.88 180 top
C15  32.1,90.12 180 top
C16  19.48,31.39 90 top
C17  19.52,23.88 270 top
C18  16.2,23.9 270 top
C19  32.91,20.39 0 top
C20  11.29,31.15 270 top
C21  13.05,23.91 270 top
C28  10.38,24.5 90 top
C29  24.8,29 0 top
C30  22.29,19.78 0 top
C34  44.67,22.09 90 top
C37  31.78,25.08 270 top
C38  33.6,25.05 270 top
C39  57.4,21.91 270 top
C40  53.85,21.91 270 top
C41  50.4,21.9 270 top
C42  47.11,21.9 270 top
C58  50.09,83.83 0 top
C60  40.73,14.46 180 top
C62  17.45,31.45 90 top
C63  17.32,27.84 270 top
C64  19.55,27.87 270 top
C65  35.94,20.36 270 top
CR1  36.74,83.02 180 top
CR2  51.21,93 270 top
CR3  19.29,95.68 0 top
CR4  9.83,83.6 180 top
CR5  101.44,55.75 270 top
D6  27.6,34.41 0 top
D7  49.9,80.74 270 top
DISPLAY  78.13,29.4 0 top
DZ1  20.03,35.1 0 top
J1  65.42,98.63 0 top
J2  11.46,100.76 0 top
J3  25.91,97.49 0 top
J4  3.41,25.67 270 top
J5  103.26,29.03 90 top
J6  44.19,100.22 180 top
J7  103.26,8.33 90 top
J8  103.26,39.38 90 top
J9  103.26,18.68 90 top
J10  6.39,25.65 270 top
L1  12.67,35.58 0 top
L2  40.21,29.36 270 top
L5  36.41,6.88 0 top
L6  36.63,16.07 0 top
LED1  18.18,50.15 90 top
LED2  39.88,58.08 90 top
LED3  39.88,50.5 90 top
LED4  17.83,58.35 90 top
Q1  42.53,81.98 0 top
Q2  49.31,57.51 90 top
Q3  21.03,90.58 0 top
Q4  14.72,11.92 90 top
Q5  49.23,60.72 90 top
Q6  49.24,54.06 90 top
Q7  49.3,64.13 90 top
R2  13.15,67.95 270 top
R3  28.15,17.02 90 top
R4  30,17.02 90 top
R5  31.83,17.02 90 top
R6  33.69,17.05 90 top
R7  33.7,5.84 270 top
R8  31.75,5.84 270 top
R9  29.81,5.84 270 top
R10  27.87,5.84 270 top
R11  32.85,22.29 0 top
R13  7.72,67.07 90 top
R14  18.09,68.51 180 top
R15  19.84,66.81 180 top
R16  26.98,70.34 0 top
R17  23.54,70.34 0 top
R18  66.62,78.04 180 top
R19  62.89,85.63 90 top
R20  66.13,76.3 0 top
R21  62.65,79.52 270 top
R22  57.25,82.94 90 top
R23  58.97,76.35 180 top
R24  73.09,78.66 270 top
R25  70.37,78.66 90 top
R26  79.7,78.66 270 top
R27  17.74,10.34 270 top
R28  77.07,78.66 90 top
R29  86.35,78.66 270 top
R30  36.8,17.87 180 top
R31  53.25,56.88 180 top
R32  83.85,78.66 90 top
R33  92.84,78.66 270 top
R34  90.02,78.66 90 top
R35  19.1,46.71 180 top
R36  41.7,75.81 0 top
R37  41.72,78.31 180 top
R38  20.94,84.7 0 top
R39  20.97,87.32 180 top
R40  18.34,72.6 90 top
R41  12.41,12.82 90 top
R42  18,14.91 270 top
R43  15.65,14.95 270 top
R44  32.79,27.4 180 top
R45  37.81,20.34 270 top
R46  14.71,72.59 270 top
R47  91.48,13.43 180 top
R48  91.48,15.77 0 top
R49  80.71,13.31 180 top
R50  50.1,85.88 180 top
R51  50.13,88.05 0 top
R52  80.73,15.83 0 top
R53  70.08,13.28 180 top
R54  70.08,15.7 0 top
R55  75.8,36.88 90 top
R56  73.31,45.86 0 top
R57  79.3,45.86 0 top
R58  42.24,9.24 0 top
R59  83.49,35.08 90 top
R60  42.4,11.33 0 top
R61  86.85,39.3 180 top
R62  53,60.07 180 top
R63  40.81,54.53 180 top
R64  52.92,53.41 180 top
R65  40.8,46.58 180 top
R66  86.89,36.4 180 top
R67  52.78,63.49 180 top
R68  18.73,54.61 180 top
R69  27.17,89.78 180 top
RSENSE  3.93,73.82 0 top
RSENSE1  66.28,86.14 0 top
S3  88.98,5.79 180 top
S4  78.18,5.79 180 top
S5  67.51,5.79 180 top
U1  10.36,67.24 270 top
U2  40.87,16.93 90 top
U3  24,67.53 0 top
U5  65.94,82.77 180 top
U6  58.56,79.47 180 top
U7  31.53,11.47 180 top
U8  79.84,58.75 270 top
U9  42.88,91.69 180 top
U10  77.79,91.06 90 top
U11  84.43,91.06 90 top
U12  26.56,24.83 0 top
U13  90.88,91.06 90 top
U14  71.14,91.06 90 top
U15  10.31,73.84 90 top
U16  9.93,91.67 0 top
U17  13.85,28.97 90 top

### Tracks (layer width: path | path; a pad name or v marks a point on that pad's centre or on a via)
A
  Top 0.61: U9.5 40.46,95.36 44.94,90.89 46.51,90.89 46.51,90.91 U9.2
  Top 1.27: J1.3 J1.1 | J1.1 J1.2 J1.4 J1.3 | J1.3 59.82,90.49 51.67,90.49 CR2.2 | CR2.2 | J1.1 65.84,98.2 59.08,91.44 51.46,91.44 51.21,91.19 CR2.2 | U9.2 CR2.2 | R51.1 49.23,90.67 49.51,90.95 CR2.2
CS
  Top 0.61: 85.96,39.31 85.96,43.02 85.95,43.03 DISPLAY.7 | R61.2 85.96,39.31 | R66.2 86,39.28 85.96,39.31
D0
  Top 0.61: R55.2 DISPLAY.3
D1
  Top 0.61: DISPLAY.4 75.57,45.86 R56.2
DSP_RST
  Top 0.61: R57.1 77.11,45.86 76.03,46.94 U8.GP22
DUT  (via drill 0.35)
  Top 0.61: R40.2 18.72,74.38 v30.63,74.38 | v44.89,74.18 52.25,74.18 54.77,71.66 64.35,71.66 67.44,71.66 68.41,70.69 U8.GP11
  Bottom 0.61: v30.63,74.38 44.68,74.38 v44.89,74.18
EN_DCDC  (via drill 0.35)
  Top 0.61: v62.18,27.65 62.02,27.49 62.02,18.1 58.69,14.77 48.52,14.77 47.83,14.07 47.83,9.9 43.9,5.98 40.48,5.98 v40.46,5.99 | v17.61,8.28 17.61,9.31 R27.2
  Bottom 0.61: U8.GP21 70.95,51.18 70.5,51.63 54.76,51.63 54.08,50.95 54.08,44.27 62.18,36.17 v62.18,27.65 | v40.46,5.99 19.9,5.99 v17.61,8.28
EN_TPS54531  (via drill 0.35)
  Top 0.508: U12.3 22.46,24.2 v22.43,24.17 | v16.75,12.56 Q4.2 R43.2
  Bottom 0.508: v22.43,24.17 22.43,15.89 19.1,12.56 v16.75,12.56
FB_DAC
  Top 0.508: U2.1 R30.1
GND  (via drill 0.3 pad 0.6, 0.35, 1.5 pad 2.5)
  Top 0.508: 70.9,78.64 77.14,78.64 83.85,78.64 89.52,78.64 | U7.16 37,8.67 v37.03,8.71 | U2.2 40.6,16.93 40.83,17.16 | 40.83,17.16 40.99,17.31 40.99,17.63 41.23,17.88 U2.6 43.22,17.88 v44.68,19.33 | C60.1 40.83,15.25 40.83,17.16 | C65.1 37.78,21.26 R45.1 44.62,21.24 C34.1
  Top 0.61: 6.04,67.56 C5.2 | 6.04,67.56 4.28,67.56 2.53,69.3 RSENSE.1 2.53,75.64 v2.82,75.93 | 6.04,67.56 6.22,67.56 6.31,67.65 R13.2 7.72,68.82 v7.72,68.83 | C6.2 24.11,64.85 C1.2 22.4,63.73 v22.39,63.71 | Q3.2 21.68,88.83 22.37,88.15 R39.1 24.04,87.31 v24.12,87.23 | J3.3 31.15,97.33 31.15,90.16 C15.2 31.2,91.16 32.06,92.02 35.96,92.02 v37.01,90.98 37.04,90.94 U9.7 | R46.1 14.71,75.64 v14.69,75.66 | U1.2 10.38,68.55 v10.38,69.67 | D7.1 47.49,81.69 47.1,82.07 | 47.1,82.07 47.1,83.06 | 47.1,83.06 47.1,83.79 | C58.1 47.15,83.83 47.1,83.79 | 47.1,83.79 47.1,85.33 47.68,85.9 49.18,85.9 R50.2 | Q2.2 v51.23,58.16 | Q7.2 50.24,64.79 v51.09,64.79 | U3.2 21.83,67.53 v21.82,67.53 | R16.2 29.02,70.34 v29.04,70.36 | C9.2 55.58,83.25 56.12,83.79 R22.2 | 63.97,86.17 64.85,86.17 RSENSE1.1 64.61,86.41 v64.61,88.5 | 63.97,86.17 63.59,86.17 63.66,86.23 v63.66,87.69 | 63.97,86.17 R19.2 62.75,86.28 v62.75,87.48 | 89.52,78.64 90.02,78.14 R34.1 | 70.9,78.64 70.38,78.11 R25.1 70.38,74.36 73.49,71.25 U8.GND@3 | 83.85,78.64 83.85,78.63 R32.1 83.85,74.23 86.19,71.89 U8.GND@2 | R28.1 77.07,78.56 77.14,78.64 | R37.1 43.12,80.99 Q1.2 v45.56,81.05 46.08,81.05 46.4,81.37 | 46.4,81.37 47.1,82.07 | R22.2 58.23,83.79 58.38,83.64 59.43,83.64 C10.2 59.44,82.11 C7.2 v58.47,82.09 v58.47,82.1 | 46.4,81.37 46.4,82.05 v45.75,82.71 | 47.1,83.06 46.31,83.85 v46.13,83.85 | R22.2 57.25,85.01 v57.23,85.03 | Q6.2 51.18,54.71 v51.18,55.02 | Q5.2 v51.04,61.37 | C38.1 33.69,26.04 R44.1 33.69,29.14 v33.52,29.3 | S4.1 77.24,3.89 76.36,4.78 74.41,4.78 73.52,3.89 S5.1 70.3,3.03 v70.36,2.97 | S4.1 84.32,3.89 85.21,4.78 87.16,4.78 88.05,3.89 S3.1 91.77,3 v91.8,2.97
  Top 0.61: S4.1 v80.97,3.11 | C12.1 75.58,15.77 v74.72,15.77 | C11.1 v85.09,15.75 v85.09,15.74 | C13.1 63.75,15.69 v63.73,15.72 | C14.2 70.71,40.28 DISPLAY.1 | U9.4 48.73,95.36 49.13,94.96 51.13,94.96 CR2.1 51.21,96.65 v51.23,96.67 | U7.10 28.36,11.2 | U7.7 28.36,11.2 | U7.9 27.09,11.41 | 27.09,11.41 U7.8 | 28.36,11.2 27.3,11.2 27.09,11.41 | 28.36,11.2 28.34,11.21 v27.73,11.21 | U5.2 v68.46,82.77 v68.46,82.78 | U6.2 60.98,79.47 v61,79.5 | U12.9 26.58,24.81 v26.58,24.41
  Top 1.016: U12.7 27.19,25.47
  Top 1.27: 27.19,25.47 U12.9
  other vias: 30.58,30.52 26.82,29.71 30.64,29.71 22.42,37.85 23.42,39.75 21.15,29.37 22.92,38.75 24.42,39.75 25.42,39.75 23.92,38.75 24.92,38.75 26.42,39.75 27.42,39.75 25.92,38.75 26.92,38.75 28.42,39.75 29.42,39.75 27.92,38.75 28.92,38.75 30.42,39.75 31.42,39.75 29.92,38.75 30.92,38.75 32.42,39.75 33.42,39.75 31.92,38.75 32.92,38.75 34.42,39.75 35.42,39.75 33.92,38.75 34.92,38.75 36.42,39.75 35.92,38.75 35.42,37.75 34.42,37.75 33.42,37.75 32.42,37.75 31.42,37.75 30.42,37.75 29.42,37.75 28.42,37.75 27.42,37.75 26.42,37.75 25.42,37.75 24.42,37.75 23.45,37.85 22.45,39.72 31.14,28.71 33.1,31.55 32.73,30.39 34.1,31.55 35.1,31.55 21.81,38.74 33.73,30.39 47.54,18.21 34.73,30.39 32.01,29.7 35.73,30.39 49.45,18.26 46.59,18.91 21.26,30.68 53.97,19.16 56.55,18.36 53.1,18.31 50.94,18.31 52.08,19.14 23.77,31.44 24.31,30.53 25.31,30.53 24.81,31.41 25.81,31.37 26.31,30.53 26.81,31.53 22.34,30.05 55.74,19.21 45.26,20.18 31.4,30.78 22.35,31.41 54.95,18.27 57.69,19 50.32,19.09 44,20.2 21.94,28.61 21.28,32.09 21.37,39.72 22.21,32.92 48.5,19.02 14.36,19.46 13.68,20.3 13.02,19.43 15.13,20.33 16.55,20.3 13.73,18.62 15.31,18.62 19.42,20.4 16.57,18.59 16.68,16.79 14.48,17.69 15.19,16.75 13.68,16.72 9.93,22.21 18.87,17.79 17.27,19.5 19.74,16.96 18.13,16.92 19.53,18.76 18.02,18.6 17.35,17.79 16.02,17.63 18,20.41 15.9,19.57 18.64,19.5 13.13,17.63 27.42,23.63 25.74,23.63 27.47,25.31 25.69,25.31 26.55,26.05 7.31,19.35 6.63,20.19 5.97,19.32 8.08,20.22 9.5,20.19 6.68,18.51 8.26,18.51 12.37,20.29 9.52,18.48 9.63,16.67 7.44,17.58 8.15,16.64 6.63,16.61 11.83,17.68 10.23,19.39 12.7,16.84 11.08,16.81 12.49,18.65 10.97,18.49 10.31,17.68 8.97,17.52 10.95,20.29 8.86,19.46 11.6,19.39 6.08,17.52 4.62,19.3 3.94,20.14 3.28,19.27 5.39,20.17 3.99,18.46 5.57,18.46 4.75,17.53 5.46,16.59 3.94,16.56 3.39,17.47 6.54,11.17 19.03,80.18
  pour Top (isolate 0.305): 20.78,40.42 20.78,27.99 43.05,27.99 43.05,40.42
  pour Top: 38.69,21.74 59.44,21.74 59.44,17.52 38.69,17.52
  pour Top: 1.92,24.15 22.19,24.15 22.19,15.26 1.92,15.26
  pour Top: 14.45,31.32 21.74,31.32 21.74,28 14.45,28
  pour Bottom (isolate 0.305, rank 3): -4.71,107.39 108.93,107.39 108.93,-2.29 -4.71,-2.29
HALL  (via drill 0.35)
  Top 0.61: J3.2 28.45,89.83 28.4,89.78 R69.1 29.46,88.89 29.46,78.71 v29.43,78.68
  Bottom 0.61: v29.43,78.68 29.69,78.94 53.02,78.94 61.19,70.77 62.69,70.77 63.47,71.56 69.94,71.56 70.95,70.56 U8.GP10
IMOTOR  (via drill 0.35)
  Top 0.61: U3.1 22.05,68.48 21.66,68.87 21.66,69.79 22.21,70.34 R17.1 22.69,71.39 24.12,72.82 v29.66,72.82 | U8.GP26_A0 81.11,47.48 83.4,45.19 87.71,45.19 96.18,36.71 96.18,13.21 101.05,8.33 J7.1 J7.2
  Top 1.016: R17.1 22.61,70.25 C4.2
  Bottom 0.61: v29.66,72.82 38.34,72.82 54.59,56.57 77.18,56.57 81.11,52.65 U8.GP26_A0
ISENSE_RAW
  Top 0.61: R2.1 11.78,68.53 U1.1
  Top 1.016: R2.1 15.17,68.53 C2.1 15.27,68.51 R14.2
ISENSE_RAW1
  Top 0.61: U5.1 67.24,79.86 C3.1 67.2,78.04 R18.1 67.16,76.46 R20.2
ITORQUE  (via drill 0.35)
  Top 0.61: U6.1 59.86,76.38 R23.1 61.62,76.35 C8.2 61.67,75.2 v61.92,74.95 | U8.GP28_A2 88.73,47.44 96.79,39.38 J8.1 J8.2
  Bottom 0.254: 82.34,71.24 82.34,65.49
  Bottom 0.61: v61.92,74.95 78.63,74.95 82.34,71.24 | U8.GP28_A2 88.73,59.1 82.34,65.49
LED1
  Top 0.61: R64.1 54.79,53.41 65.87,64.49 U8.GP12
LED2
  Top 0.61: R31.1 54.92,56.88 63.33,65.28 U8.GP13
LED3
  Top 0.61: R62.1 54.67,60.07 57.99,63.39 57.99,67.39 U8.GP14
LED4
  Top 0.61: R67.1 54.54,63.49 55.72,64.66 U8.GP15
MISO
  Top 0.61: U8.GP16 55.71,43.59 65.16,34.14 83.46,34.14 R59.1
MOSI
  Top 0.61: R56.1 66.64,45.86 65.87,46.63 U8.GP19
MOTDUT+
  Top 0.61: J2.1 9.04,98.33 9.04,91.27 7.97,90.21 U16.3
MOTDUT-
  Top 0.61: U16.6 11.5,90.21 10.72,90.99 10.72,97.48 J2.2
MOTLOAD+
  Top 0.61: J6.1 44.14,100.16 44.14,94.19 45.18,93.15 U9.3 | U9.3 | U9.3
MOTLOAD-
  Top 0.61: J6.2 37.69,100.22 36.53,99.06 36.53,93.99 37.37,93.15 U9.6
N$1
  Top 0.508: R3.1 28.15,15.49 28.27,15.37 29.09,15.37 29.63,14.84 U7.6
N$2
  Top 0.508: R4.1 30,15.52 30.21,15.3 30.66,15.3 30.9,15.07 U7.5
N$3
  Top 0.508: U7.4 32.17,15.03 31.83,15.36 R5.1
N$4
  Top 0.508: R6.1 33.69,15.49 33.44,15.24 U7.3
N$5
  Top 0.508: R7.1 33.44,6.99 U7.14
N$6
  Top 0.61: 13,67.22 R2.2 | 13,67.22 10.14,67.22 9.41,66.49 U1.4 9.41,64.91 9.06,64.56 8.08,64.56 7.72,64.92 R13.1 | C2.2 13.44,66.78 13,67.22
N$7
  Top 0.508: R8.1 32.17,7.15 U7.13
N$8
  Top 0.508: R9.1 30.9,7.82 U7.12
N$9
  Top 0.508: R10.1 28.73,7.59 29.12,7.59 29.63,8.11 U7.11
N$11
  Top 0.61: R35.2 18.2,48.87 LED1.A
N$12
  Top 0.61: Q2.3 48.02,57.51 43.79,53.28 35.87,53.28 34.02,51.42 LED1.K
N$13
  Top 0.61: U3.4 24.47,66.58 24.05,66.99 24.05,69.06 24.39,69.4 R17.2 24.4,70.34 R16.1
N$14
  Top 1.016: C4.1 20.61,68.51 R14.1 18.94,66.87 R15.2
N$15
  Top 0.61: U3.3 20.93,66.58
  Top 1.016: C1.1 20.69,64.86 R15.1 20.93,66.58
N$17
  Top 0.61: R19.1 62.88,84.12 63.29,83.72 U5.4 65.54,83.72 65.87,83.4 65.87,81.08 65.5,80.72 C3.2 65.52,79.81 65.52,79.18 66.05,78.65 R18.2
N$18
  Top 0.61: R22.1 57.27,82.07 U6.4 58.39,80.42 58.5,80.32 58.5,77.99 58.12,77.61 R23.2
N$19
  Top 0.508: R7.2 R8.2 R9.2 R10.2 26.3,4.94 25.71,5.53 25.71,16.75 26.88,17.92 R3.2
  Top 0.61: U12.5 31.32,22.93 R11.1 32.01,22.23 C19.1 31.83,20.21 R5.2 | R45.2 37.78,19.46 C65.2 35.94,17.91 R30.2 33.77,17.87 R6.2 33.66,17.92 R5.2 | R5.2 R4.2 | R4.2 | R4.2 R3.2
N$20
  Top 0.61: R21.2 63.15,78.67 63.37,78.45 C8.1 65.16,76.38 R20.1
N$21
  Top 0.61: Q2.1 52.33,56.86 R31.2
N$22
  Top 0.61: U6.3 62.6,80.42 R21.1 62.65,81.35 61.9,82.09 C7.1
N$24  (via drill 0.35)
  Top 0.305: U14.4 73.05,86.48 v73.08,86.44 | 73.14,80.11 R24.1
  Top 0.61: R25.2 R24.1 73.03,80 73.11,80 73.14,80.03 73.14,80.11 v73.14,82.05
  Bottom 0.305: v73.08,86.44 73.08,82.11 v73.14,82.05
N$25  (via drill 0.35)
  Top 0.305: R26.1 79.7,80.22 79.7,81.9 | v79.74,86.69 79.74,88.36 U10.4
  Top 0.61: R28.2 77.23,80.22 79.7,80.22 | R26.1 79.7,81.9 v79.77,81.97
  Bottom 0.305: v79.77,81.97 79.77,86.66 v79.74,86.69
N$26  (via drill 0.35)
  Top 0.305: U11.4 v86.34,86.56
  Top 0.61: R32.2 R29.1 86.37,80.08 v86.37,81.97
  Bottom 0.305: v86.34,86.56 86.34,82 v86.37,81.97
N$27  (via drill 0.35)
  Top 0.305: R33.1 92.84,80.3 v92.84,82.04 v92.83,82.05 | v92.81,86.56 92.81,88.38 U13.4
  Top 0.61: R34.2 90.26,80.3 92.84,80.3 | R33.1 v92.84,82.04
  Bottom 0.305: v92.83,82.05 92.83,86.53 v92.81,86.56
N$28
  Top 0.61: R36.1 40.32,75.83 R37.2 40.32,80.41 40.96,81.05 Q1.1
N$29
  Top 0.61: CR1.1 42.42,83.02 Q1.3 42.53,87.12 41.91,87.74 U9.8
N$31
  Top 0.61: R38.1 19.57,84.74 R39.2 19.57,87.99 20.38,88.81 Q3.1
N$33
  Top 0.61: U16.7 14.78,92.42 16.1,91.09 16.1,84.29 15.41,83.6 CR4.1 | U16.4 11.19,88 11.88,87.31 CR4.1 | 11.72,78.35 11.88,78.5 | 11.88,78.5 12.14,78.77 | 11.88,78.5 CR4.1
  Top 1.016: 9.7,78.67 8.38,78.67 8.38,76.52 U15.8 U15.5 12.21,78.7 12.14,78.77 | 9.7,78.67 10.83,78.67 | 10.83,78.67 11.33,78.67 11.37,78.7 11.72,78.35 | U15.7 9.67,78.64 9.7,78.67 | U15.6 10.94,78.56 10.83,78.67
N$34
  Top 1.016: R40.1 18.34,71.19 R46.2 U15.4
N$35
  Top 0.508: Q4.3 R41.1
N$38
  Top 0.61: S3.3 91.77,9.54 92.38,10.14 R47.1 R48.2
N$39
  Top 0.61: R52.2 81.61,15.82 R49.1 81.61,10.31 80.97,9.67 S4.3
N$40
  Top 0.508: U7.2 34.71,15.11 34.89,15.29 34.89,15.99 34.88,16.01 34.94,16.07 L6.1
N$41
  Top 0.61: S5.3 70.98,8.38 R53.1 R54.2
N$43
  Top 0.61: R59.2 83.49,43.02 DISPLAY.6
N$44
  Top 0.508: C30.2 23.86,20.44 U12.4
N$45
  Top 0.508: U2.5 44.38,16.93 44.78,16.53 44.78,10.58 43.44,9.24 R58.2
N$47
  Top 0.61: U12.1 23.86,28.96 C29.1
N$48
  Top 0.508: R60.2 43.84,11.88 43.84,15.81 43.67,15.98 U2.4
N$49
  Top 0.61: Q5.1 R62.2
N$50
  Top 0.61: R63.2 39.88,54.56 LED2.A
N$51
  Top 0.254: U12.8 29.26,27.43
  Top 0.61: C29.2 25.7,28.02 26.3,27.42 27.83,27.42 28.51,26.74 U12.8
  Top 2: 29.26,27.43 28.75,27.93
  Top 2.54: L2.1 31,34.11 D6.2 29.73,34.41 28.75,33.43 28.75,27.93
N$52
  Top 0.61: U12.6 31.76,24.2 C37.2 33.57,24.18 C38.2
N$53
  Top 0.61: C37.1 31.89,26.09 R44.2
N$54
  Top 0.508: L5.1 34.71,7.68 U7.15
N$55
  Top 0.61: LED2.K 40.06,59.16 46.4,59.16 47.96,60.72 Q5.3
N$56
  Top 0.61: Q6.1 R64.2
N$58
  Top 0.61: R65.2 39.9,49.23 LED3.A
N$59
  Top 0.61: Q6.3 48.31,53.47 46.62,51.77 LED3.K
N$62
  Top 0.61: Q7.1 R67.2
N$63
  Top 0.61: R68.2 LED4.A
N$64
  Top 0.61: LED4.K 34.8,59.62 39.31,64.13 Q7.3
N$69
  Top 0.508: U17.6 11.31,30.27 C20.2
N$70
  Top 0.508: L1.1 11.29,35.56 C20.1 12.99,32.05 13.86,31.19 U17.5
N$75
  Top 1.016: CR5.2 101.43,53.69 U8.VSYS
N$78
  Top 0.61: U16.8 13.59,95.68 CR3.1 17.24,93.49 19.23,91.5 Q3.3
POL_DUT  (via drill 0.35)
  Top 0.61: R36.2 51.77,75.81 55.11,72.47 v61.92,72.47
  Bottom 0.61: v61.92,72.47 62.74,73.29 76.78,73.29 78.57,71.5 U8.GP8
POL_LOAD  (via drill 0.35)
  Top 0.61: R38.2 22.34,81.86 24.38,79.81 v26.45,79.81
  Bottom 0.61: v26.45,79.81 53.3,79.81 61.52,71.59 62.35,71.59 63.21,72.45 74.41,72.45 76.03,70.83 U8.GP9
R1
  Top 0.61: R33.2 92.84,75.38 96.35,71.87 U8.GP2
R2
  Top 0.61: U8.GP3 93.81,71.19 92.17,72.83 88.4,72.83 86.35,74.87 R29.2
R3
  Top 0.61: U8.GP6 83.65,71.02 79.7,74.97 R26.2
R4
  Top 0.61: U8.GP7 81.11,70.57 78.97,72.71 74.96,72.71 73.08,74.59 73.08,77.25 R24.2
RESPOT1
  Top 1.27: J1.17 85.74,96.95 U13.8 U13.5 88.28,98.22 J1.19 | J1.17 J1.18 J1.20 J1.19 | J1.19 87.22,98.63 | 87.22,98.63 J1.17 | U13.7 85.74,98.22 J1.17 | U13.6 87.22,98.01 87.22,98.63
RESPOT2
  Top 1.27: J1.15 J1.16 J1.14 J1.13 | J1.15 J1.13 | J1.13 80.72,98.57 80.72,96.77 81.27,96.22 81.27,94.98 U11.8 U11.5 83.2,96.86 J1.15 | U11.7 82.33,95.19 82.33,96.87 80.66,98.54 J1.13 | U11.6 82.66,96.12 82.66,98.1 J1.15
RESPOT3
  Top 1.27: 75.88,98.33 U10.8 U10.5 79.69,95.64 79.13,96.2 78.42,96.91 | 75.88,98.33 75.88,98.6 76.16,98.6 76.19,98.63 | 75.88,98.33 J1.9 J1.10 J1.12 J1.11 | U10.7 77.15,97.93 76.32,98.76 76.19,98.63 | U10.6 78.42,96.91 | J1.11 78.42,98.33 78.42,96.91 | J1.11 76.19,98.63
RESPOT4
  Top 1.27: J1.7 J1.8 J1.6 J1.5 | J1.7 J1.5 | U14.7 70.51,98.62 J1.5 | J1.5 69.24,97.38 U14.8 U14.5 73.05,98.62 J1.7 | U14.6 71.78,97.35 J1.5
RST
  Top 0.61: DISPLAY.5 80.86,45.19 R57.2
SAFETY_EN_DCDC
  Top 0.508: Q4.1 17.72,11.27 R27.1 18,11.5 R42.2
SCK
  Top 0.61: U8.GP18 63.33,39.35 66.69,35.98 R55.1
SCL  (via drill 0.35)
  Top 0.508: 41.28,9.24 R58.1
  Top 0.61: U8.GP5 88.73,61.63 81.33,54.23 v73.89,54.23 v73.88,54.23 | v60.26,27.69 60.39,27.56 60.39,18.77 58.33,16.71 46.3,16.71 45.98,16.39 45.98,10.35 43.61,7.99 39.49,7.99 40.7,9.2 | 41.28,9.24 41.25,9.2 40.7,9.2 | 40.7,9.2 38.37,6.88 L5.2
  Bottom 0.61: v60.26,27.69 60.26,34.4 51.69,42.97 51.69,52.2 53.72,54.23 v73.88,54.23
SDA  (via drill 0.35)
  Top 0.508: L6.2 37.53,14.79 39.39,12.92 40.98,11.33 R60.1
  Top 0.61: 39.39,12.92 39.39,11.82 v39.33,11.75 | v72.76,53.17 81.72,53.17 91.27,62.72 U8.GP4 | v40.31,6.96 | v40.31,6.96 43.73,6.96 47.01,10.24 47.01,15.21 47.7,15.9 58.67,15.9 61.21,18.44 61.21,27.7 v61.24,27.74
  Bottom 0.61: v39.33,11.75 40.31,10.77 v40.31,6.96 | v61.24,27.74 61.24,34.92 52.72,43.45 52.72,51.75 54.15,53.17 v72.76,53.17
SS
  Top 0.406: 88.64,35.08 65.91,35.08
  Top 0.61: U8.GP17 58.25,42.74 65.91,35.08 | R61.1 88.73,39.3 89.32,38.71 89.32,35.76 88.64,35.08
TEST_1  (via drill 0.35)
  Top 0.61: C13.2 66.41,15.7 R54.1 69.18,26.9 v68.86,27.23
  Bottom 0.61: U8.GP20 68.41,27.67 v68.86,27.23
TEST_2  (via drill 0.35)
  Top 0.254: v95.16,43.55 95.16,51.53
  Top 0.61: C12.2 77.44,15.83 R52.1 79.83,24.14 92.48,36.79 v92.48,39.03 | U8.GP1 101.43,64.78 95.9,59.25 95.9,52.27 95.16,51.53
  Bottom 0.61: v92.48,39.03 92.54,39.1 92.54,40.93 v95.16,43.55
TEST_3  (via drill 0.35)
  Top 0.254: v95.98,42.84 96.12,42.84 97.63,44.35 97.63,51.55
  Top 0.61: C11.2 90.57,15.75 R48.1 90.58,33.36 93.7,36.48 v93.7,38.04 | 97.63,51.55 96.81,52.36 96.81,58.88 104.01,66.07 104.01,67.53 103.97,67.56 U8.GP0
  Bottom 0.61: v95.98,42.84 95.98,42.78 93.7,40.5 v93.7,38.04
VBUS  (via drill 0.35)
  Top 0.61: U16.5 12.63,88 11.61,89.03 4.68,89.03 4.23,88.57 | 4.23,88.57 4.23,87.36 5.13,86.45 7.34,86.45 7.79,86 CR4.2 5.75,83.6 3.9,81.75 v3.9,80.67 | U16.2 4.47,92.42 4.21,92.15 4.21,88.59 4.23,88.57 | v45.62,26.64 43.78,26.64 43.78,39.54 42.12,41.2 v21.1,41.2 | C19.2 33.81,22.23 R11.2 34.85,22.29 37.17,24.61 L2.2
  Bottom 0.61: v21.1,41.2 2.67,41.2 1.38,42.49 1.38,78.14 v3.9,80.67
  other vias: 44.24,25.81 50.51,25.15 50.66,26.03 49.53,26.22 49.23,25.27 48.24,25.3 47.13,25.4 46.81,26.43 47.83,26.3 48.6,26.38 46.53,27.39 47.62,27.37 48.68,27.37 49.7,27.37 50.54,27.34 44.48,26.96 43.46,26.96 43.46,24.89 44.45,24.92 53.91,24.98 54.07,25.87 52.94,26.06 52.64,25.11 51.64,25.14 51.23,26.61 52,26.22 52.08,27.21 53.11,27.21 53.95,27.18 58.04,25.02 58.2,25.9 57.06,26.09 56.76,25.15 55.77,25.17 55.36,26.17 56.13,26.25 56.21,27.25 57.24,27.25 58.07,27.21
  pour Top: 37.75,27.62 59.39,27.62 59.39,22.52 59,22.13 37.75,22.13
  pour Bottom: 37.83,27.62 59.39,27.62 59.39,22.52 59,22.13 37.83,22.13
VCC  (via drill 0.35)
  Top 0.61: C5.1 6.02,64.74 7.04,63.72 11.11,63.72 11.31,63.92 U1.5 | R69.2 26.15,89.78 25.91,90.02 J3.1 | C9.1 55.75,78.53 U6.5 | C10.1 62,83.65 63.83,81.82 U5.5 | C14.1 73.25,40.22 DISPLAY.2 | C60.2 41.14,13.15 v41.14,13.09
  Bottom 0.61: v41.14,13.09 48.85,13.09 v49.13,13.36
  pour Top (isolate 0.305, rank 3): -4.71,107.29 109.03,107.29 109.03,-2.43 -4.71,-2.43
VDUT
  Top 0.61: U1.3 9.41,68.94 8.68,69.67 6.02,69.67 5.33,70.36 RSENSE.2 | RSENSE.2
  Top 1.016: U15.3 U15.2 U15.1 8.4,73.06 7.64,73.82 RSENSE.2
VIN
  Top 0.508: R41.2 12.41,14.26 12.09,14.59 2.54,14.59 1.03,16.1 1.03,25.45 1.25,25.67 J4.1
  Top 1.27: U12.2 19.54,25.47 C17.1
  pour Top: 1.79,24.61 1.79,27.59 22.16,27.59 22.16,27.54 22.16,24.61
VLOAD
  Top 0.61: U5.3 68.57,83.72 69.02,84.17 69.02,85.8 68.68,86.14 RSENSE1.2
  Top 1.016: 69.21,86.93 69.24,86.96 U14.1 U14.3 71.78,87.18 71.72,87.12 | U14.2 70.51,86.87 70.38,86.74 | 76.12,86.68 75.88,86.92 U10.1 U10.3 78.42,86.96 78.46,86.93 | U10.2 77.15,86.92 77.27,86.8 | 82.66,86.61 82.53,86.74 U11.1 U11.3 85.07,86.81 85.04,86.79 | U11.2 83.8,86.85 83.89,86.75 | 89.1,86.71 88.97,86.84 U13.1 U13.3 91.51,87.03 | U13.2 90.24,86.67 90.22,86.64
  pour Top: 66.54,89.92 94.37,89.92 94.37,84.93 66.54,84.93
VSENSE_A  (via drill 0.35)
  Top 0.61: R51.2 51.03,85.9 R50.1 50.99,85.86 C58.2 51,83.82 D7.3 51,77.9 55.17,73.73 v61.92,73.73 | J5.1 J5.2 103.23,31.57 88.54,46.26 84.49,46.26 83.65,47.1 U8.GP27_A1
  Bottom 0.254: 79.8,72.2 79.8,65.81
  Bottom 0.61: U8.GP27_A1 83.65,61.97 79.8,65.81 | 79.8,72.2 77.9,74.1 62.3,74.1 v61.92,73.73

### Text on the board
tPlace: MOTOR LOAD | MOTOR DUT | + | S | - | + | - | - | + | GND | TestMotorFaulhaber / Oct24-v1 | ILOAD | VSENSE_A | + | - | GND | IMOTOR | GND